# Altium project Sidekick Carrier - Rev. 1.PrjPcb (part 3 of 6)

## Sheet 6 Bluetooth.SchDoc
size B; DocumentNumber: 6; SheetNumber: 6; SheetTotal: 17
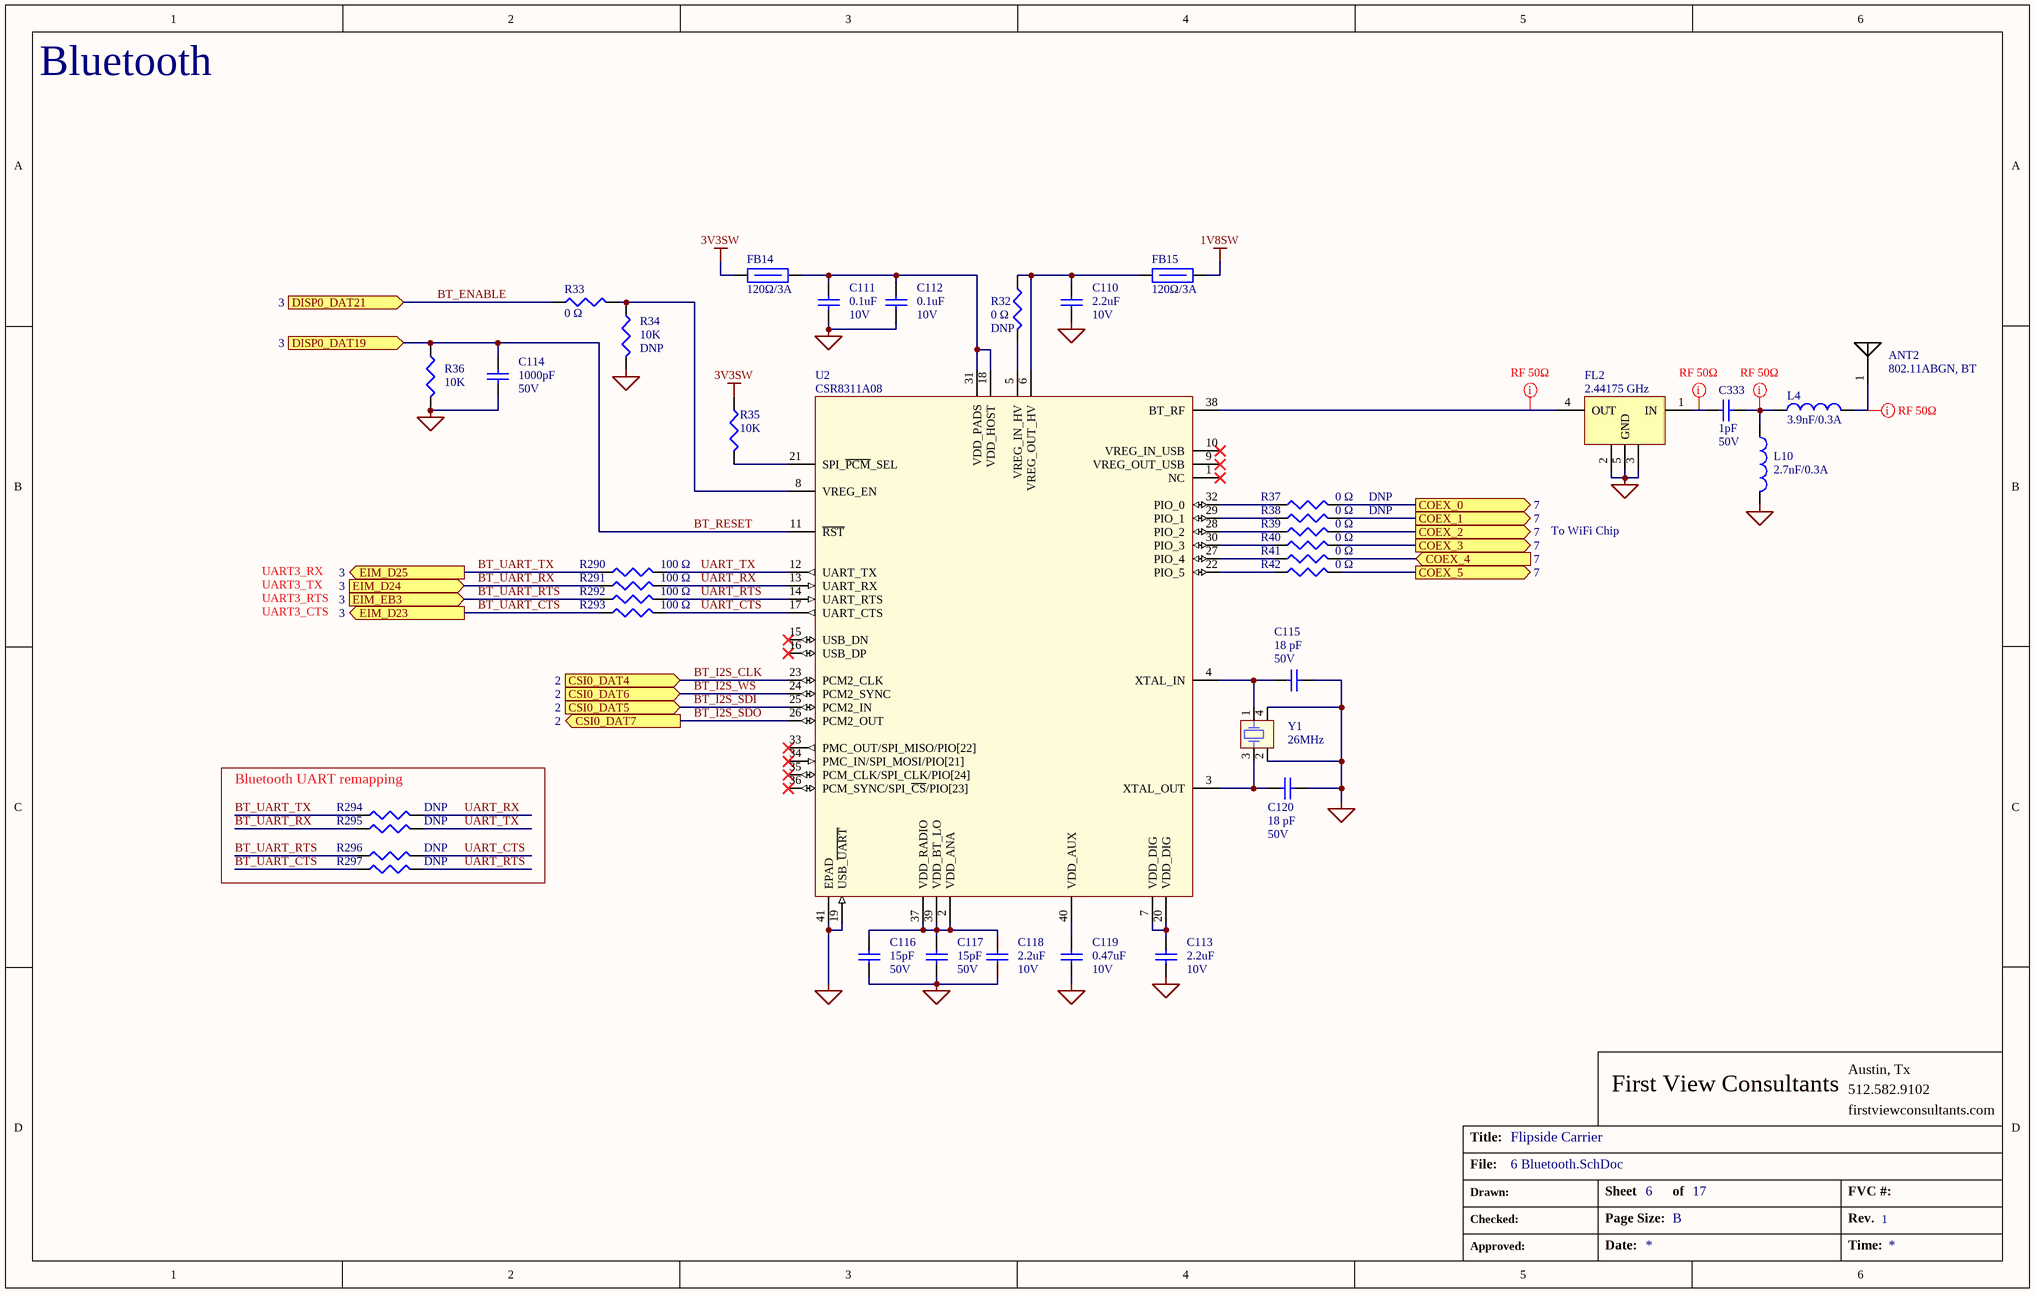
[diagram p5: 6 Bluetooth.SchDoc]

### Parts
ANT2  value 802.11ABGN, BT  [ANT_2450AT18A100E]  (hidden comment: 2450AT18A100E)
C110  value 2.2uF  Voltage: 10V  [CAP_0402]  (hidden comment: Cap 2.2uF 10V 0402)
C111  value 0.1uF  Voltage: 10V  [CAP_0402]  (hidden comment: Cap 0.1uF 10V 0402)
C112  value 0.1uF  Voltage: 10V  [CAP_0402]  (hidden comment: Cap 0.1uF 10V 0402)
C113  value 2.2uF  Voltage: 10V  [CAP_0402]  (hidden comment: Cap 2.2uF 10V 0402)
C114  value 1000pF  Voltage: 50V  [CAP_0603]  (hidden comment: Cap 1000pF 50V 0603)
C115  value 18 pF  Voltage: 50V  [CAP_0402]  (hidden comment: Cap 18pF 50V 0402)
C116  value 15pF  Voltage: 50V  [CAP_0402]  (hidden comment: Cap 15pF 50V 0402)
C117  value 15pF  Voltage: 50V  [CAP_0402]  (hidden comment: Cap 15pF 50V 0402)
C118  value 2.2uF  Voltage: 10V  [CAP_0402]  (hidden comment: Cap 2.2uF 10V 0402)
C119  value 0.47uF  Voltage: 10V  [CAP_0402]  (hidden comment: Cap 0.47uF 10V 0402)
C120  value 18 pF  Voltage: 50V  [CAP_0402]  (hidden comment: Cap 18pF 50V 0402)
C333  value 1pF  Voltage: 50V  [CAP_0402]  (hidden comment: Cap 1pF 50V 0402 RF)
FB14  value 120Ω/3A  [IND_0603]  (hidden comment: BLM18KG121TN1D)
FB15  value 120Ω/3A  [IND_0603]  (hidden comment: BLM18KG121TN1D)
FL2  value 2.44175 GHz  [SMD(1.3x1.1)_B39242B9413K610]  (hidden comment: B39242B9413K610)
L4  value 3.9nF/0.3A  [IND_RF_0402]  (hidden comment: L-07C3N9SV6T)
L10  value 2.7nF/0.3A  [IND_RF_0402]  (hidden comment: L-07C2N7SV6T)
R32  value 0 Ω  [RES_0402]  (hidden comment: Res 0 ohm 0.1W)
R33  value 0 Ω  [RES_0402]  (hidden comment: Res 0 ohm 0.1W)
R34  value 10K  [RES_0402]  (hidden comment: Res 10K 0.063W)
R35  value 10K  [RES_0402]  (hidden comment: Res 10K 0.063W)
R36  value 10K  [RES_0402]  (hidden comment: Res 10K 0.063W)
R37  value 0 Ω  [RES_0402]  (hidden comment: Res 0 ohm 0.1W)
R38  value 0 Ω  [RES_0402]  (hidden comment: Res 0 ohm 0.1W)
R39  value 0 Ω  [RES_0402]  (hidden comment: Res 0 ohm 0.1W)
R40  value 0 Ω  [RES_0402]  (hidden comment: Res 0 ohm 0.1W)
R41  value 0 Ω  [RES_0402]  (hidden comment: Res 0 ohm 0.1W)
R42  value 0 Ω  [RES_0402]  (hidden comment: Res 0 ohm 0.1W)
R290  value 100 Ω  [RES_0402]  (hidden comment: Res 100R 0.063W)
R291  value 100 Ω  [RES_0402]  (hidden comment: Res 100R 0.063W)
R292  value 100 Ω  [RES_0402]  (hidden comment: Res 100R 0.063W)
R293  value 100 Ω  [RES_0402]  (hidden comment: Res 100R 0.063W)
R294  Res 0 ohm 0.1W DNP  [RES_0402]  (value not drawn)
R295  Res 0 ohm 0.1W DNP  [RES_0402]  (value not drawn)
R296  Res 0 ohm 0.1W DNP  [RES_0402]  (value not drawn)
R297  Res 0 ohm 0.1W DNP  [RES_0402]  (value not drawn)
U2  CSR8311A08  [QFN-40_CSR8311A08]
Y1  value 26MHz  [DFN(3.2x2.5)_403I35D26M00000]  (hidden comment: 403I35D26M00000)

### Blocks framed on the sheet
Bluetooth UART remapping: R294-R297

### Ports
COEX_0 (out, see 7), COEX_1 (out, see 7), COEX_2 (out, see 7), COEX_3 (out, see 7), COEX_4 (in, see 7), COEX_5 (out, see 7), CSI0_DAT4 (in, see 2), CSI0_DAT5 (in, see 2), CSI0_DAT6 (in, see 2), CSI0_DAT7 (out, see 2), DISP0_DAT19 (in, see 3), DISP0_DAT21 (in, see 3), EIM_D23 (out, see 3), EIM_D24 (in, see 3), EIM_D25 (out, see 3), EIM_EB3 (in, see 3)

### Nets
1V8SW: FB15.2
3V3SW: FB14.1 R35.1
GND: C110.2 C111.2 C112.2 C113.2 C114.2 C115.1 C116.2 C117.2 C118.2 C119.2 C120.1 FL2.2(GND) FL2.3(GND) FL2.5(GND) L10.2 R34.2 R36.2 U2.19(USB_~{UART}) U2.41(EPAD) Y1.2 Y1.4
BT_ENABLE: R33.1 ; port DISP0_DAT21
BT_I2S_CLK: U2.23(PCM2_CLK) ; port CSI0_DAT4
BT_I2S_SDI: U2.25(PCM2_IN) ; port CSI0_DAT5
BT_I2S_SDO: U2.26(PCM2_OUT) ; port CSI0_DAT7
BT_I2S_WS: U2.24(PCM2_SYNC) ; port CSI0_DAT6
BT_RESET: C114.1 R36.1 U2.11(~{RST}) ; port DISP0_DAT19
BT_UART_CTS: R293.1 R297.1 ; port EIM_D23
BT_UART_RTS: R292.1 R296.1 ; port EIM_EB3
BT_UART_RX: R291.1 R295.1 ; port EIM_D24
BT_UART_TX: R290.1 R294.1 ; port EIM_D25
COEX_0: R37.2 ; port COEX_0
COEX_1: R38.2 ; port COEX_1
COEX_2: R39.2 ; port COEX_2
COEX_3: R40.2 ; port COEX_3
COEX_4: R41.2 ; port COEX_4
COEX_5: R42.2 ; port COEX_5
UART_CTS: R293.2 R296.2 U2.17(UART_CTS)
UART_RTS: R292.2 R297.2 U2.14(UART_RTS)
UART_RX: R291.2 R294.2 U2.13(UART_RX)
UART_TX: R290.2 R295.2 U2.12(UART_TX)
NetANT2_1: ANT2.1 L4.2
NetC110_1: C110.1 FB15.1 R32.1 U2.6(VREG_OUT_HV)
NetC111_1: C111.1 C112.1 FB14.2 U2.18(VDD_HOST) U2.31(VDD_PADS)
NetC113_1: C113.1 U2.7(VDD_DIG) U2.20(VDD_DIG)
NetC115_2: C115.2 U2.4(XTAL_IN) Y1.1(OSC1)
NetC116_1: C116.1 C117.1 C118.1 U2.2(VDD_ANA) U2.37(VDD_RADIO) U2.39(VDD_BT_LO)
NetC119_1: C119.1 U2.40(VDD_AUX)
NetC120_2: C120.2 U2.3(XTAL_OUT) Y1.3(OSC2)
NetC333_1: C333.1 FL2.1(IN)
NetC333_2: C333.2 L4.1 L10.1
NetFL2_4: FL2.4(OUT) U2.38(BT_RF)
NetR32_2: R32.2 U2.5(VREG_IN_HV)
NetR33_2: R33.2 R34.1 U2.8(VREG_EN)
NetR35_2: R35.2 U2.21(SPI_~{PCM}_SEL)
NetR37_1: R37.1 U2.32(PIO_0)
NetR38_1: R38.1 U2.29(PIO_1)
NetR39_1: R39.1 U2.28(PIO_2)
NetR40_1: R40.1 U2.30(PIO_3)
NetR41_1: R41.1 U2.27(PIO_4)
NetR42_1: R42.1 U2.22(PIO_5)

Not connected (* = marked no-connect by the designer): U2 1(NC)* 9(VREG_OUT_USB)* 10(VREG_IN_USB)* 15(USB_DN)* 16(USB_DP)* 33(PMC_OUT/SPI_MISO/PIO[22])* 34(PMC_IN/SPI_MOSI/PIO[21])* 35(PCM_CLK/SPI_CLK/PIO[24])* 36(PCM_SYNC/SPI_~{CS}/PIO[23])*

### Layout directives
net class RF 50ohm: NetANT2_1, NetC333_1, NetC333_2, NetFL2_4

### Notes on the sheet
- Bluetooth
- To WiFi Chip
- UART3_RX
- UART3_TX
- UART3_RTS
- UART3_CTS
- First View Consultants
- Austin, Tx
- 512.582.9102
- Title:
- File:
- firstviewconsultants.com
- Drawn:
- Checked:
- Sheet
- Page Size:
- of
- B
- FVC #:
- Rev.
- Approved:
- Date:
- Time:

### Library data of the parts
ANT2 = 2450AT18A100E: Antenna, WiFi/BT, SMD; Manufacturer: Johanson Technology, Inc.; Manufacturer #: 2450AT18A100E
C110 C113 C118 = Cap 2.2uF 10V 0402: Cap, Cer, 2.2uF, 10V, 10%, X5R, 0402; Manufacturer #: C0402C225M8PACTU; Manufacturer: Kemet; Have Footprint: yes; Package: 0402
C111 C112 = Cap 0.1uF 10V 0402: Cap, Cer, 0.1uF, 10V, 10%, X5R, 0402; Manufacturer: Murata Electronics North America; Manufacturer #: GRM155R61A104KA01J; Have Footprint: yes; Tolerance: ±10%; PACKAGE: 0402
C114 = Cap 1000pF 50V 0603: Cap, Cer, 1000pF, 50V, 10%, X7S, 0603; Manufacturer: Yageo; Manufacturer #: CC0603KRX7R9BB102; Have Footprint: yes; Tolerance: 10%; PACKAGE: 0402
C115 C120 = Cap 18pF 50V 0402: Cap, Cer, 18pF, 50V, 5%, C0G, 0402; Manufacturer #: C1005C0G1H180J050BA; Manufacturer: TDK Corporation; Have Footprint: yes; Package: 0402
C116 C117 = Cap 15pF 50V 0402: Cap, Cer, 15pF, 50V, 5%, C0G/NP0, 0402; Manufacturer: Murata Electronics North America; Manufacturer #: GRM1555C1H150JA01D; Have Footprint: yes; Tolerance: 5%; PACKAGE: 0402
C119 = Cap 0.47uF 10V 0402: Cap, Cer, 0.47uF, 10V, 10%, X5R, 0402; Manufacturer: TDK Corporation; Manufacturer #: C1005X5R1A474K050BB; Have Footprint: yes; Package: 0402; Tolerance: ±10%
C333 = Cap 1pF 50V 0402 RF: Cap, Cer, 0.1uF, 50V, 10%, X5R, 0402; Manufacturer #: CBR04C109C5GAC; Manufacturer: Kemet; Have Footprint: yes; Tolerance: ±10%; PACKAGE: 0402
FB14 FB15 = BLM18KG121TN1D: Ind, Ferrite Bead, 120R, 20mOhm, 3A, 0603; Manufacturer: Murata Electronics North America; Have Footprint: yes; RoHS: yes; Package: 0603; Manufacturer #: BLM18KG121TN1D
FL2 = B39242B9413K610: Filter, Saw, 2.44175 GHz, BT, SMD; Manufacturer: EPCOS (TDK); Package: SMD (1.4x1.1); RoHS: yes; Manufacturer #: B39242B9413K610
L4 = L-07C3N9SV6T: Ind, RF, 3.9nH, 0.3A, 220 mOhm, 0402; Manufacturer: Johanson Technology Inc; RoHS: yes; Operating Temperature: -40°C ~ 100°C; Package: 0402; Manufacturer #: L-07C3N9SV6T
L10 = L-07C2N7SV6T: Ind, RF, 2.7nH, 0.3A, 170 mOhm, 0402; Manufacturer: Johanson Technology Inc; RoHS: yes; Operating Temperature: -40°C ~ 100°C; Package: 0402; Manufacturer #: L-07C2N7SV6T
R32 R33 R37-R42 = Res 0 ohm 0.1W: Res, 0 ohm, 1/16W, 0402; Manufacturer #: CRCW04020000Z0ED; Manufacturer: Vishay Dale; Have Footprint: yes; Package: 0402
  R32 R37 R38: DNP: DNP
R34-R36 = Res 10K 0.063W: Res, 10K, 1/16W, 1%, 0402; Manufacturer #: RC0402FR-0710KL; Manufacturer: Yageo; Have Footprint: yes; Package: 0402
  R34: DNP: DNP
R290-R293 = Res 100R 0.063W: Res, 100R, 0.063W, 1%, 0402; Manufacturer #: TRR01MZPF1000; Manufacturer: Murata Electronics North America; Have Footprint: yes; Package: 0402
R294-R297 = Res 0 ohm 0.1W DNP: Res, 0 ohm, 1/16W, 0402; Manufacturer #: CRCW04020000Z0ED; Manufacturer: Vishay Dale; Have Footprint: yes; Value: 0 Ω; Package: 0402; DNP: DNP
U2 = CSR8311A08: IC, Bluetooth, 40-QFN; Manufacturer: CSR PLC; Manufacturer #: CSR8311A08-AQQD-R; Have Footprint: yes; Cost: 3.0048; Value: CSR8311A08; Package: QFN-40
Y1 = 403I35D26M00000: Clock, Crystal, 26MHz, 50ppm, 18pf, -40+85°C, SMD; Manufacturer: CTS-Frequency Controls; Package: DFN(3.2x2.5mm); Manufacturer #: 403I35D26M00000

## Sheet 7 WiFi.SchDoc
size C; DocumentNumber: 7; SheetNumber: 7; SheetTotal: 17
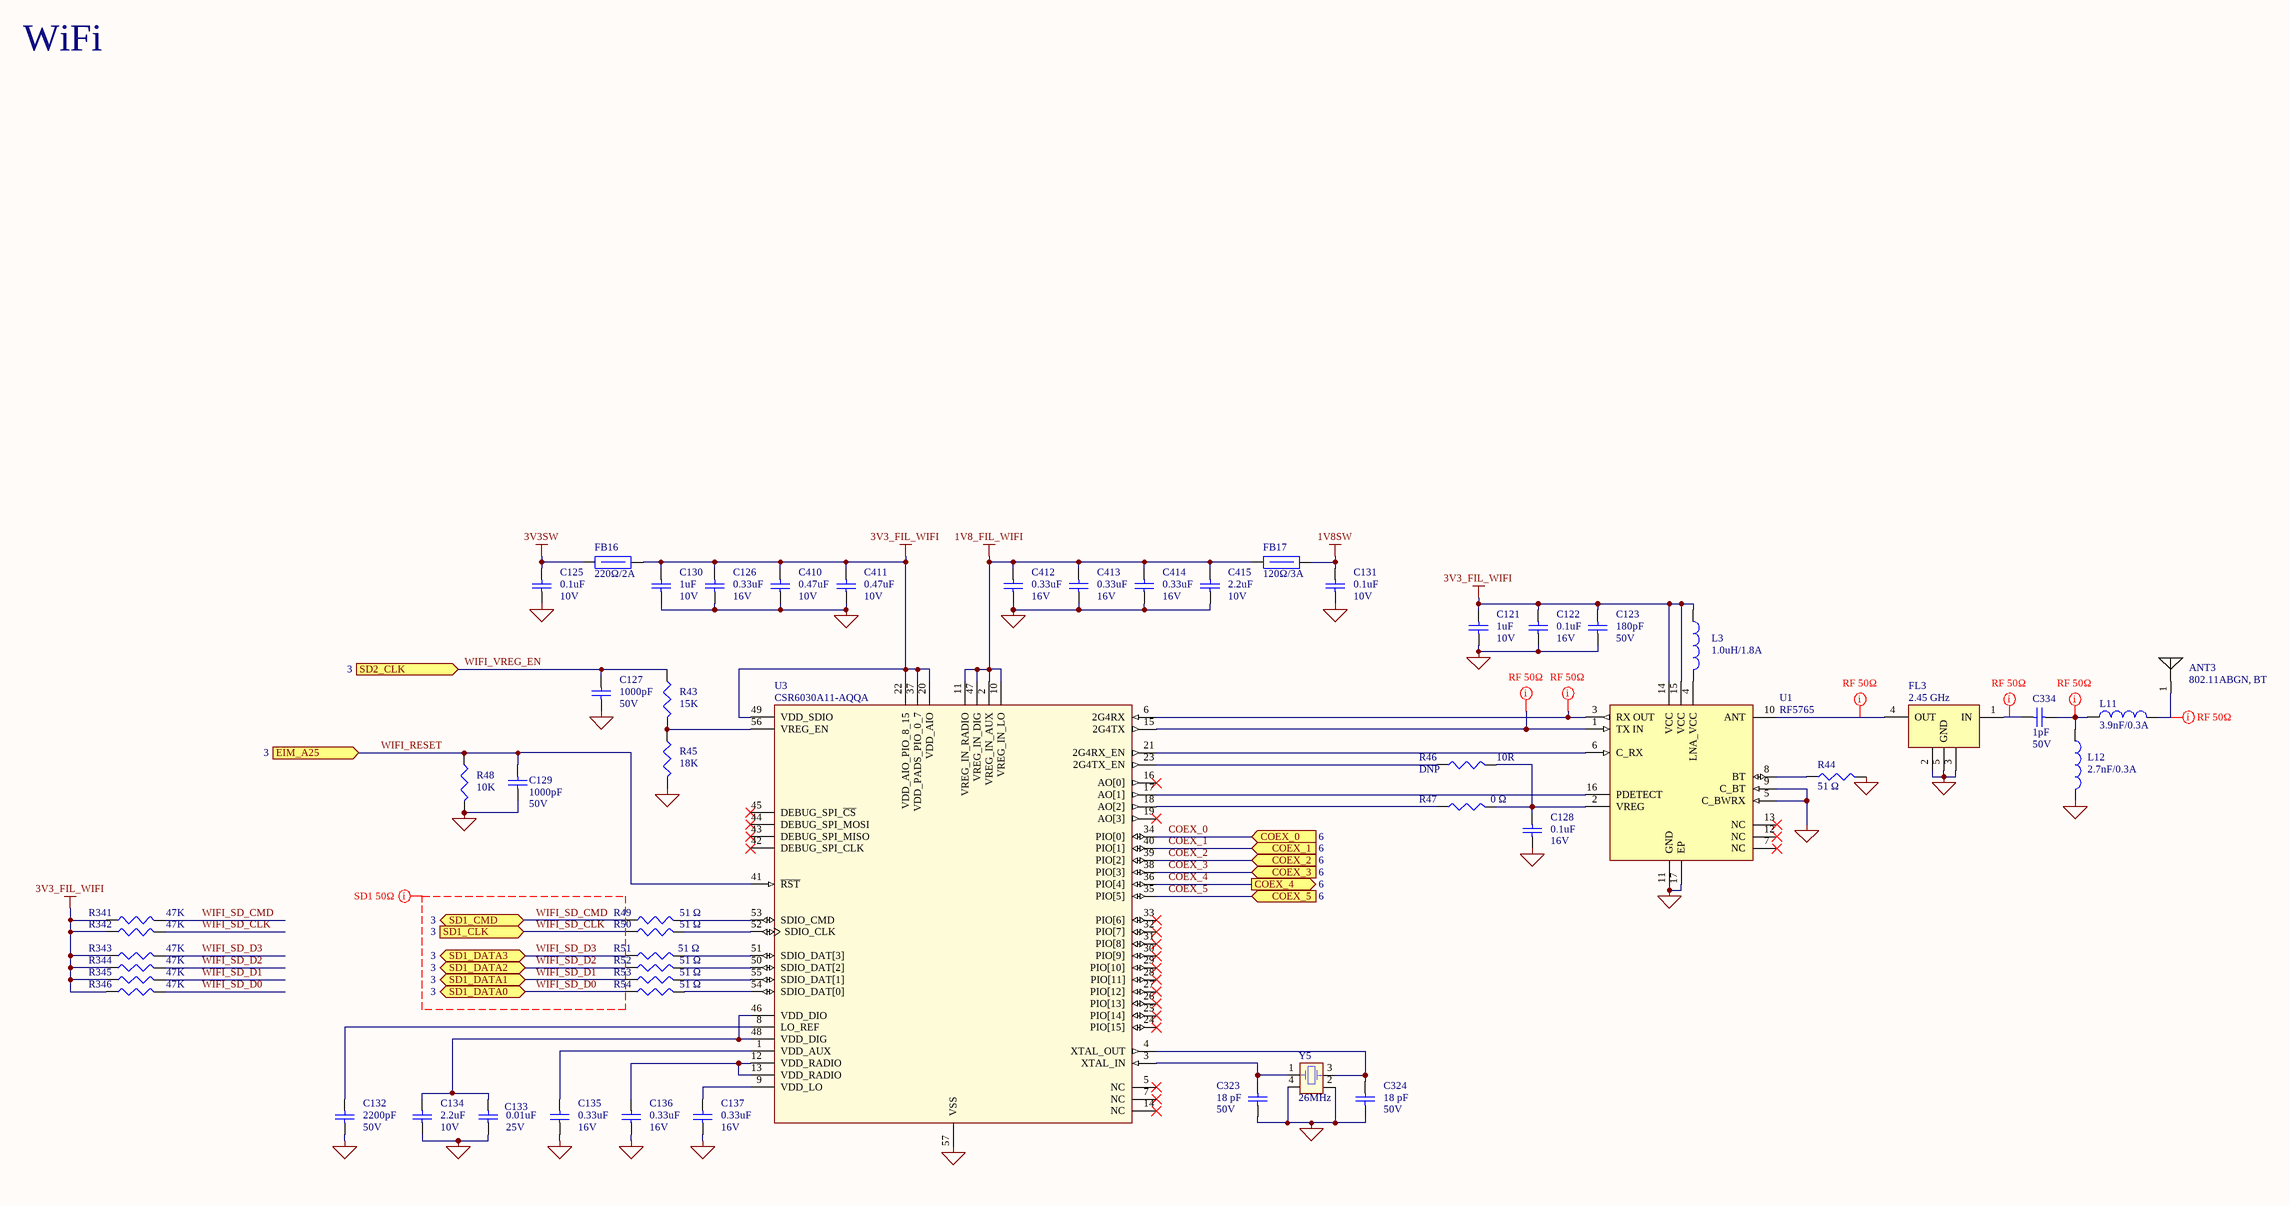
[diagram p6: 7 WiFi.SchDoc]

### Parts
ANT3  value 802.11ABGN, BT  [ANT_2450AT18A100E]  (hidden comment: 2450AT18A100E)
C121  value 1uF  Voltage: 10V  [CAP_0402]  (hidden comment: Cap 1uF 10V 0402)
C122  value 0.1uF  Voltage: 16V  [CAP_0402]  (hidden comment: Cap 0.1uF 16V 0402)
C123  value 180pF  Voltage: 50V  [CAP_0402]  (hidden comment: Cap 180pF 50V 0402)
C125  value 0.1uF  Voltage: 10V  [CAP_0402]  (hidden comment: Cap 0.1uF 10V 0402)
C126  value 0.33uF  Voltage: 16V  [CAP_0402]  (hidden comment: Cap 0.33uF 16V 0402)
C127  value 1000pF  Voltage: 50V  [CAP_0603]  (hidden comment: Cap 1000pF 50V 0603)
C128  value 0.1uF  Voltage: 16V  [CAP_0402]  (hidden comment: Cap 0.1uF 16V 0402)
C129  value 1000pF  Voltage: 50V  [CAP_0603]  (hidden comment: Cap 1000pF 50V 0603)
C130  value 1uF  Voltage: 10V  [CAP_0402]  (hidden comment: Cap 1uF 10V 0402)
C131  value 0.1uF  Voltage: 10V  [CAP_0402]  (hidden comment: Cap 0.1uF 10V 0402)
C132  value 2200pF  Voltage: 50V  [CAP_0402]  (hidden comment: Cap 2200pF 50V 0402)
C133  value 0.01uF  Voltage: 25V  [CAP_0402]  (hidden comment: Cap 0.01uF 50V 0402)
C134  value 2.2uF  Voltage: 10V  [CAP_0402]  (hidden comment: Cap 2.2uF 10V 0402)
C135  value 0.33uF  Voltage: 16V  [CAP_0402]  (hidden comment: Cap 0.33uF 16V 0402)
C136  value 0.33uF  Voltage: 16V  [CAP_0402]  (hidden comment: Cap 0.33uF 16V 0402)
C137  value 0.33uF  Voltage: 16V  [CAP_0402]  (hidden comment: Cap 0.33uF 16V 0402)
C323  value 18 pF  Voltage: 50V  [CAP_0402]  (hidden comment: Cap 18pF 50V 0402)
C324  value 18 pF  Voltage: 50V  [CAP_0402]  (hidden comment: Cap 18pF 50V 0402)
C334  value 1pF  Voltage: 50V  [CAP_0402]  (hidden comment: Cap 1pF 50V 0402 RF)
C410  value 0.47uF  Voltage: 10V  [CAP_0402]  (hidden comment: Cap 0.47uF 10V 0402)
C411  value 0.47uF  Voltage: 10V  [CAP_0402]  (hidden comment: Cap 0.47uF 10V 0402)
C412  value 0.33uF  Voltage: 16V  [CAP_0402]  (hidden comment: Cap 0.33uF 16V 0402)
C413  value 0.33uF  Voltage: 16V  [CAP_0402]  (hidden comment: Cap 0.33uF 16V 0402)
C414  value 0.33uF  Voltage: 16V  [CAP_0402]  (hidden comment: Cap 0.33uF 16V 0402)
C415  value 2.2uF  Voltage: 10V  [CAP_0402]  (hidden comment: Cap 2.2uF 10V 0402)
FB16  value 220Ω/2A  [IND_0805]  (hidden comment: BKP2125HS221-T)
FB17  value 120Ω/3A  [IND_0603]  (hidden comment: BLM18KG121TN1D)
FL3  value 2.45 GHz  [SMD(1.3x1.1)_B39252B9430M410]  (hidden comment: B39252B9430M410)
L3  value 1.0uH/1.8A  [IND_VLS252010T-1R0N]  (hidden comment: VLS252010T-1R0N)
L11  value 3.9nF/0.3A  [IND_RF_0402]  (hidden comment: L-07C3N9SV6T)
L12  value 2.7nF/0.3A  [IND_RF_0402]  (hidden comment: L-07C2N7SV6T)
R43  value 15K  [RES_0402]  (hidden comment: Res 15K 0.1W)
R44  value 51 Ω  [RES_0402]  (hidden comment: Res 51R 0.063W)
R45  value 18K  [RES_0402]  (hidden comment: Res 18K 0.063W)
R46  value 10R  [RES_0402]  (hidden comment: Res 10R 0.1W)
R47  value 0 Ω  [RES_0402]  (hidden comment: Res 0 ohm 0.1W)
R48  value 10K  [RES_0402]  (hidden comment: Res 10K 0.063W)
R49  value 51 Ω  [RES_0402]  (hidden comment: Res 51R 0.063W)
R50  value 51 Ω  [RES_0402]  (hidden comment: Res 51R 0.063W)
R51  value 51 Ω  [RES_0402]  (hidden comment: Res 51R 0.063W)
R52  value 51 Ω  [RES_0402]  (hidden comment: Res 51R 0.063W)
R53  value 51 Ω  [RES_0402]  (hidden comment: Res 51R 0.063W)
R54  value 51 Ω  [RES_0402]  (hidden comment: Res 51R 0.063W)
R341  value 47K  [RES_0402]  (hidden comment: Res 47K 0.1W)
R342  value 47K  [RES_0402]  (hidden comment: Res 47K 0.1W)
R343  value 47K  [RES_0402]  (hidden comment: Res 47K 0.1W)
R344  value 47K  [RES_0402]  (hidden comment: Res 47K 0.1W)
R345  value 47K  [RES_0402]  (hidden comment: Res 47K 0.1W)
R346  value 47K  [RES_0402]  (hidden comment: Res 47K 0.1W)
U1  RF5765  [QFN-16_RF5765]
U3  CSR6030A11-AQQA  [QFN-56_CSR6030A11-AQQA]
Y5  value 26MHz  [DFN(3.2x2.5)_403I35D26M00000]  (hidden comment: 403I35D26M00000)

### Ports
COEX_0 (in, see 6), COEX_1 (in, see 6), COEX_2 (in, see 6), COEX_3 (in, see 6), COEX_4 (out, see 6), COEX_5 (in, see 6), EIM_A25 (in, see 3), SD1_CLK (in, see 3), SD1_CMD (bidir, see 3), SD1_DATA0 (bidir, see 3), SD1_DATA1 (bidir, see 3), SD1_DATA2 (bidir, see 3), SD1_DATA3 (bidir, see 3), SD2_CLK (in, see 3)

### Nets
1V8_FIL_WIFI: C412.1 C413.1 C414.1 C415.1 FB17.1 U3.2(VREG_IN_AUX) U3.10(VREG_IN_LO) U3.11(VREG_IN_RADIO) U3.47(VREG_IN_DIG)
1V8SW: C131.1 FB17.2
3V3_FIL_WIFI: C121.1 C122.1 C123.1 C126.1 C130.1 C410.1 C411.1 FB16.2 L3.1 R341.1 R342.1 R343.1 R344.1 R345.1 R346.1 U1.14(VCC) U1.15(VCC) U3.20(VDD_AIO) U3.22(VDD_AIO_PIO_8_15) U3.37(VDD_PADS_PIO_0_7) U3.49(VDD_SDIO)
3V3SW: C125.1 FB16.1
GND: C121.2 C122.2 C123.2 C125.2 C126.2 C127.2 C128.2 C129.2 C130.2 C131.2 C132.2 C133.2 C134.2 C135.2 C136.2 C137.2 C323.2 C324.2 C410.2 C411.2 C412.2 C413.2 C414.2 C415.2 FL3.2(GND) FL3.3(GND) FL3.5(GND) L12.2 R44.2 R45.2 R48.2 U1.5(C_BWRX) U1.9(C_BT) U1.11(GND) U1.17(EP) U3.57(VSS) Y5.2 Y5.4
COEX_0: U3.34(PIO[0]) ; port COEX_0
COEX_1: U3.40(PIO[1]) ; port COEX_1
COEX_2: U3.39(PIO[2]) ; port COEX_2
COEX_3: U3.38(PIO[3]) ; port COEX_3
COEX_4: U3.36(PIO[4]) ; port COEX_4
COEX_5: U3.35(PIO[5]) ; port COEX_5
WIFI_RESET: C129.1 R48.1 U3.41(~{RST}) ; port EIM_A25
WIFI_SD_CLK: R50.1 R342.2 ; port SD1_CLK
WIFI_SD_CMD: R49.1 R341.2 ; port SD1_CMD
WIFI_SD_D0: R54.1 R346.2 ; port SD1_DATA0
WIFI_SD_D1: R53.1 R345.2 ; port SD1_DATA1
WIFI_SD_D2: R52.1 R344.2 ; port SD1_DATA2
WIFI_SD_D3: R51.1 R343.2 ; port SD1_DATA3
WIFI_VREG_EN: C127.1 R43.1 ; port SD2_CLK
NetANT3_1: ANT3.1 L11.2
NetC128_1: C128.1 R46.2 R47.2 U1.2(VREG)
NetC132_1: C132.1 U3.8(LO_REF)
NetC133_1: C133.1 C134.1 U3.46(VDD_DIO) U3.48(VDD_DIG)
NetC135_1: C135.1 U3.1(VDD_AUX)
NetC136_1: C136.1 U3.12(VDD_RADIO) U3.13(VDD_RADIO)
NetC137_1: C137.1 U3.9(VDD_LO)
NetC323_1: C323.1 U3.3(XTAL_IN) Y5.1(OSC1)
NetC324_1: C324.1 U3.4(XTAL_OUT) Y5.3(OSC2)
NetC334_1: C334.1 FL3.1(IN)
NetC334_2: C334.2 L11.1 L12.1
NetFL3_4: FL3.4(OUT) U1.10(ANT)
NetL3_2: L3.2 U1.4(LNA_VCC)
NetR43_2: R43.2 R45.1 U3.56(VREG_EN)
NetR44_1: R44.1 U1.8(BT)
NetR46_1: R46.1 U3.23(2G4TX_EN)
NetR47_1: R47.1 U3.18(AO[2])
NetR49_2: R49.2 U3.53(SDIO_CMD)
NetR50_2: R50.2 U3.52(SDIO_CLK)
NetR51_2: R51.2 U3.51(SDIO_DAT[3])
NetR52_2: R52.2 U3.50(SDIO_DAT[2])
NetR53_2: R53.2 U3.55(SDIO_DAT[1])
NetR54_2: R54.2 U3.54(SDIO_DAT[0])
NetU1_1: U1.1(TX_IN) U3.15(2G4TX)
NetU1_3: U1.3(RX_OUT) U3.6(2G4RX)
NetU1_6: U1.6(C_RX) U3.21(2G4RX_EN)
NetU1_16: U1.16(PDETECT) U3.17(AO[1])

Not connected (* = marked no-connect by the designer): U1 7(NC)* 12(NC)* 13(NC)*; U3 5(NC)* 7(NC)* 14(NC)* 16(AO[0])* 19(AO[3])* 24(PIO[15])* 25(PIO[14])* 26(PIO[13])* 27(PIO[12])* 28(PIO[11])* 29(PIO[10])* 30(PIO[9])* 31(PIO[8])* 32(PIO[7])* 33(PIO[6])* 42(DEBUG_SPI_CLK)* 43(DEBUG_SPI_MISO)* 44(DEBUG_SPI_MOSI)* 45(DEBUG_SPI_~{CS})*

### Layout directives
net class RF 50ohm: NetANT3_1, NetC334_1, NetC334_2, NetFL3_4, NetU1_1, NetU1_3
net class SD1 50ohm: WIFI_SD_CLK, WIFI_SD_CMD, WIFI_SD_D0, WIFI_SD_D1, WIFI_SD_D2, WIFI_SD_D3

### Notes on the sheet
- WiFi
- First View Consultants
- Austin, Tx
- 512.582.9102
- firstviewconsultants.com
- Title:
- File:
- Drawn:
- Sheet
- of
- FVC #:
- Checked:
- Approved:
- Date:
- Page Size:
- C
- Rev.
- Time:

### Library data of the parts
ANT3 = 2450AT18A100E: as ANT2 on sheet 6 Bluetooth; Manufacturer #: 2450AT18A100E
C121 C130 = Cap 1uF 10V 0402: Cap, Cer, 1uF, 10V, ±10%, X5R, 0402; Manufacturer #: CC0402KRX5R6BB105; Manufacturer: Yageo; Have Footprint: yes; Package: 0402
C122 C128 = Cap 0.1uF 16V 0402: Cap, Cer, 0.1uF, 16V, 10%, X7R, 0402; Manufacturer #: GRM155R71C104KA88D; Manufacturer: Murata Electronics North America; Have Footprint: yes; Package: 0402; Tolerance: ±10%
C123 = Cap 180pF 50V 0402: Cap, Cer, 180pF, 50V, 5%, NP0, 0402; Manufacturer: Murata Electronics North America; Manufacturer #: GRM1555C1H181JA01J; Have Footprint: yes; Tolerance: 5%; PACKAGE: 0402
C125 C131 = Cap 0.1uF 10V 0402: as C111 on sheet 6 Bluetooth; Tolerance: ±10%; PACKAGE: 0402
C126 C135-C137 C412-C414 = Cap 0.33uF 16V 0402: Cap, Cer, 0.33uF, 16V, 10%, X5R, 0402; Manufacturer: TDK Corporation; Manufacturer #: C1005X5R1C334K050BC; Have Footprint: yes; Tolerance: 10%; PACKAGE: 0402
C127 C129 = Cap 1000pF 50V 0603: as C114 on sheet 6 Bluetooth; Tolerance: 10%; PACKAGE: 0402
C132 = Cap 2200pF 50V 0402: Cap, Cer, 2200pF, 50V, 5%, X7R, 0402; Manufacturer #: GRM155R71H222JA01J; Manufacturer: Murata Electronics North America; Have Footprint: yes; Package: 0402; Tolerance: 5%
C133 = Cap 0.01uF 50V 0402: Cap, Cer, 0.01uF, 25V, ±10%, X7R, 0402; Manufacturer #: GRM155R71E103KA01J; Manufacturer: Murata; Have Footprint: yes; Tolerance: ±10%; Package: 0402
C134 C415 = Cap 2.2uF 10V 0402: as C110 on sheet 6 Bluetooth; Package: 0402
C323 C324 = Cap 18pF 50V 0402: as C115 on sheet 6 Bluetooth; Package: 0402
C334 = Cap 1pF 50V 0402 RF: as C333 on sheet 6 Bluetooth; Tolerance: ±10%; PACKAGE: 0402
C410 C411 = Cap 0.47uF 10V 0402: as C119 on sheet 6 Bluetooth; Package: 0402; Tolerance: ±10%
FB16 = BKP2125HS221-T: Ind, Ferrite Bead, 220R, 50mOhm, 2A, 0805; Manufacturer: Taiyo Yuden; Manufacturer #: BKP2125HS221-T; Package: 0805
FB17 = BLM18KG121TN1D: as FB14 on sheet 6 Bluetooth; RoHS: yes; Package: 0603; Manufacturer #: BLM18KG121TN1D
FL3 = B39252B9430M410: Filter, Saw, 2.45 GHz, WLAN, SMD; Manufacturer: EPCOS (TDK); Package: SMD (1.4x1.1); RoHS: yes; Manufacturer #: B39252B9430M410
L3 = VLS252010T-1R0N: Ind, Power, 1uH, 1.8A, 85mOhm, Shielded, SMD; Manufacturer: TDK Corporation; Tolerance: ±20%; Package: SMD (2.5x2); Manufacturer #: VLS252010T-1R0N
L11 = L-07C3N9SV6T: as L4 on sheet 6 Bluetooth; RoHS: yes; Operating Temperature: -40°C ~ 100°C; Package: 0402; Manufacturer #: L-07C3N9SV6T
L12 = L-07C2N7SV6T: as L10 on sheet 6 Bluetooth; RoHS: yes; Operating Temperature: -40°C ~ 100°C; Package: 0402; Manufacturer #: L-07C2N7SV6T
R43 = Res 15K 0.1W: Res, 15K, 0.1W, 1%, 0402; Manufacturer #: ERJ-2GEJ153X; Manufacturer: Panasonic Electronic Components; Have Footprint: yes; Package: 0402
R44 R49-R54 = Res 51R 0.063W: Res, 51R, 0.063W, 1%, 0402; Manufacturer #: MCR01MRTF51R0; Manufacturer: Rohm Semiconductor; Have Footprint: yes; Package: 0402
R45 = Res 18K 0.063W: Res, 18K, 0.063W, 1%, 0402; Manufacturer #: MCR01MRTF1802; Manufacturer: Rohm Semiconductor; Have Footprint: yes; Package: 0402; Tolerance: 1%
R46 = Res 10R 0.1W: Res, 10R, 0.1W, 0402; Manufacturer #: ERJ-2GEJ100X; Manufacturer: Panasonic Electronic Components; Have Footprint: yes; DNP: DNP; Package: 0402
R47 = Res 0 ohm 0.1W: as R32 on sheet 6 Bluetooth; Package: 0402
R48 = Res 10K 0.063W: as R34-R36 on sheet 6 Bluetooth; Package: 0402
R341-R346 = Res 47K 0.1W: Res, 47K, 0.1W, 1%, 0402; Manufacturer #: ERJ-2RKF4702X; Manufacturer: Panasonic Electronic Components; Have Footprint: yes; Package: 0402
U1 = RF5765: IC, WiFi 802.11b/g/n FEM, 3-4.8V, 2.4-2.5GHz, QFN-16; Manufacturer: RFMD; Have Footprint: yes; RoHS: yes; Manufacturer #: RF5765
U3 = CSR6030A11-AQQA: IC, WiFi, QFN-56; Manufacturer: CSR PLC; Value: CSR6030A11-AQQA; Manufacturer #: CSR6030A11-AQQA; Package: QFN-56
Y5 = 403I35D26M00000: as Y1 on sheet 6 Bluetooth; Package: DFN(3.2x2.5mm); Manufacturer #: 403I35D26M00000

## Sheet 8 GPS.SchDoc
size B; DocumentNumber: 8; SheetNumber: 8; SheetTotal: 17
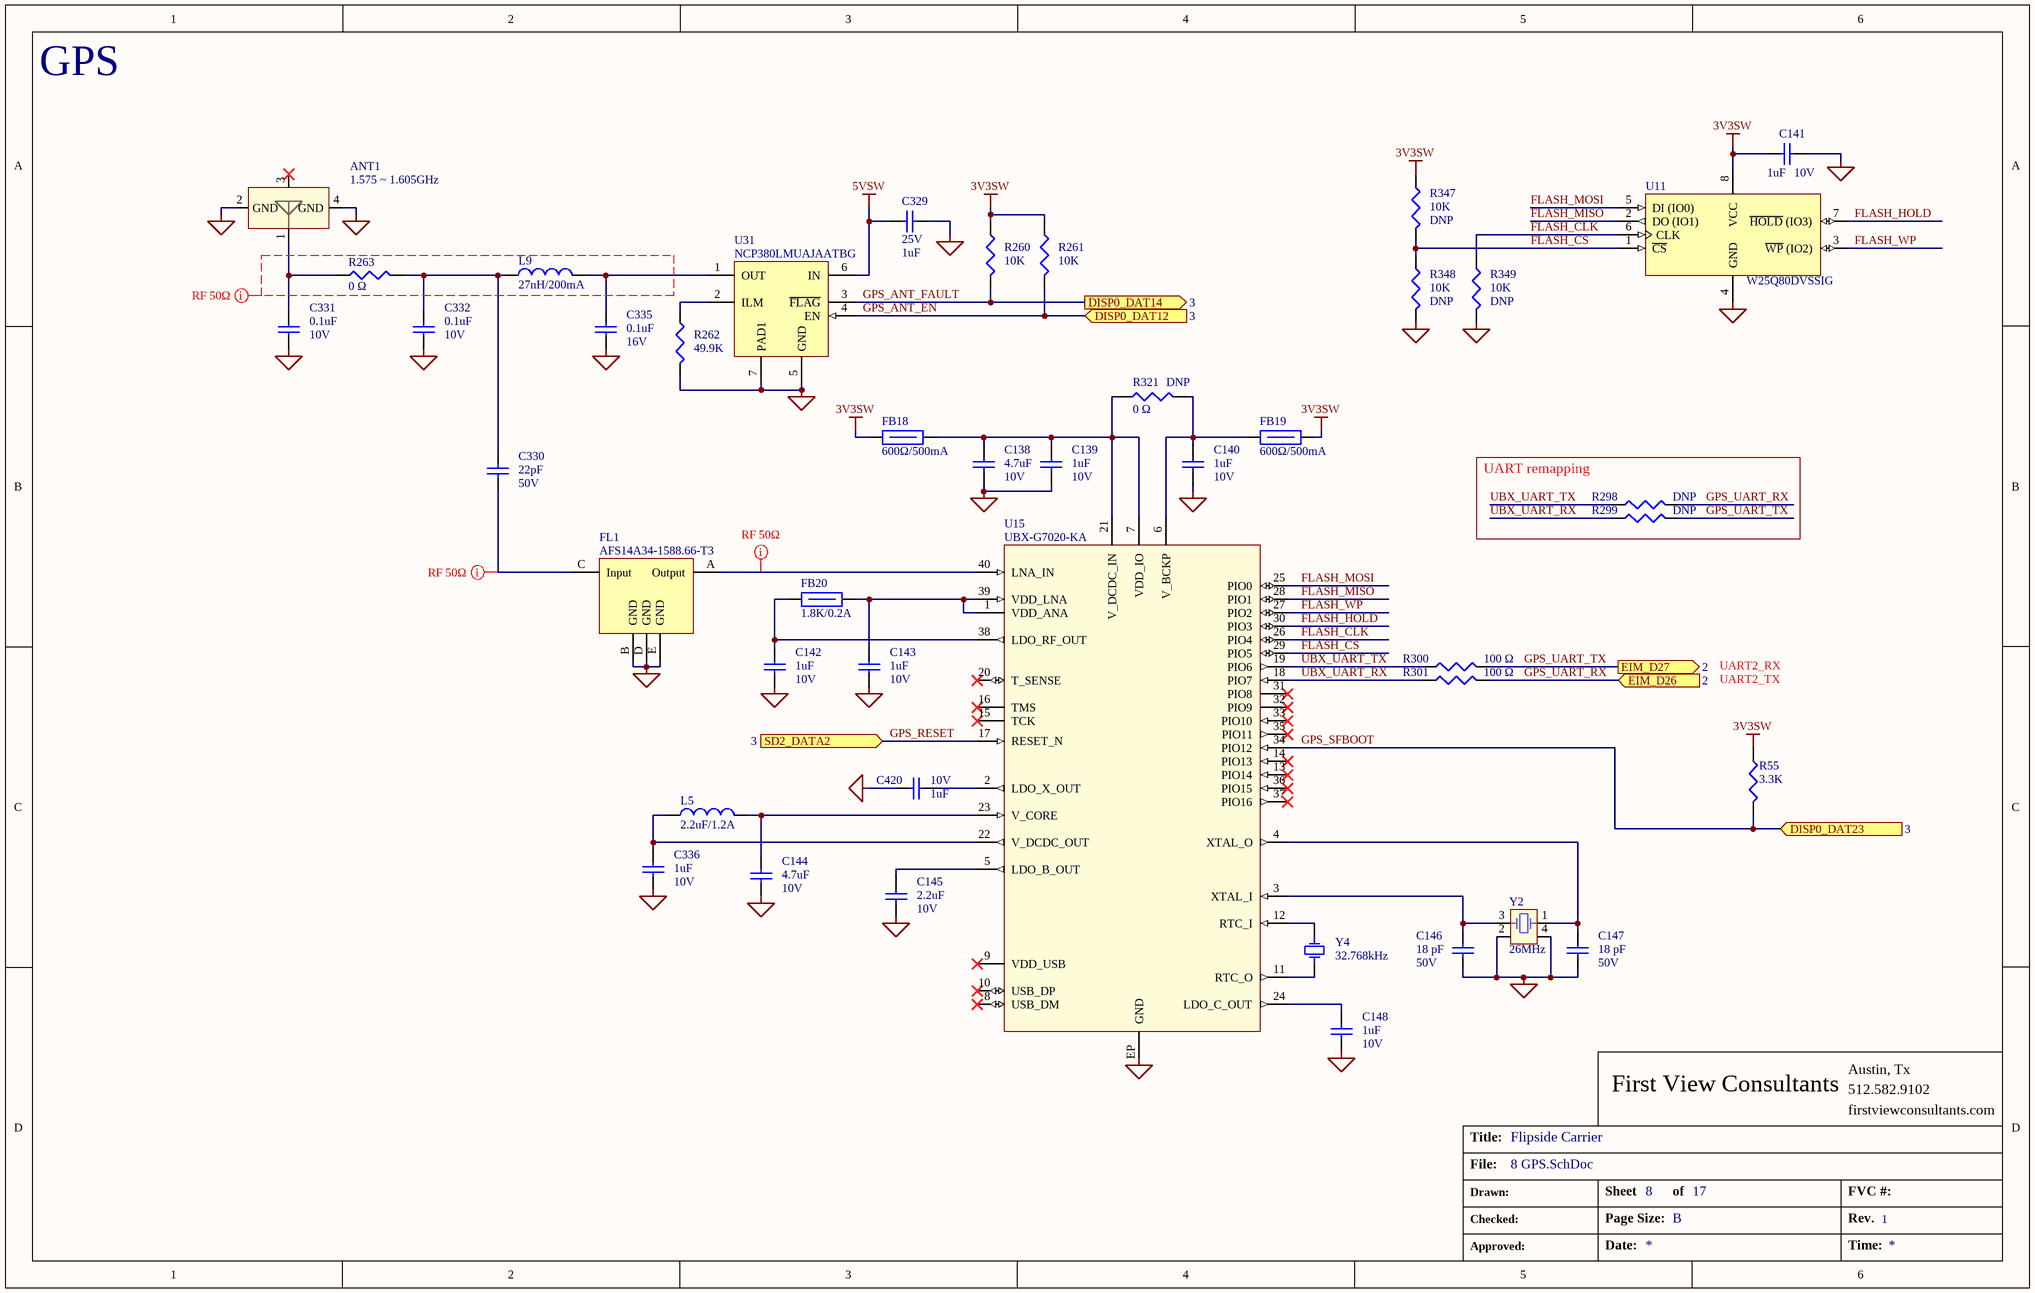
[diagram p7: 8 GPS.SchDoc]

### Parts
ANT1  value 1.575 ~ 1.605GHz  [ANT_1575AT54A0010E]  (hidden comment: 1575AT54A0010E)
C138  value 4.7uF  Voltage: 10V  [CAP_0402]  (hidden comment: Cap 4.7uF 10V 0603)
C139  value 1uF  Voltage: 10V  [CAP_0402]  (hidden comment: Cap 1uF 10V 0402)
C140  value 1uF  Voltage: 10V  [CAP_0402]  (hidden comment: Cap 1uF 10V 0402)
C141  value 1uF  Voltage: 10V  [CAP_0402]  (hidden comment: Cap 1uF 10V 0402)
C142  value 1uF  Voltage: 10V  [CAP_0402]  (hidden comment: Cap 1uF 10V 0402)
C143  value 1uF  Voltage: 10V  [CAP_0402]  (hidden comment: Cap 1uF 10V 0402)
C144  value 4.7uF  Voltage: 10V  [CAP_0402]  (hidden comment: Cap 4.7uF 10V 0603)
C145  value 2.2uF  Voltage: 10V  [CAP_0402]  (hidden comment: Cap 2.2uF 10V 0402)
C146  value 18 pF  Voltage: 50V  [CAP_0402]  (hidden comment: Cap 18pF 50V 0402)
C147  value 18 pF  Voltage: 50V  [CAP_0402]  (hidden comment: Cap 18pF 50V 0402)
C148  value 1uF  Voltage: 10V  [CAP_0402]  (hidden comment: Cap 1uF 10V 0402)
C329  value 1uF  Voltage: 25V  [CAP_0402]  (hidden comment: Cap 1uF 25V 0402)
C330  value 22pF  Voltage: 50V  [CAP_0402]  (hidden comment: Cap 22pF 50V 0402)
C331  value 0.1uF  Voltage: 10V  [CAP_0402]  (hidden comment: Cap 0.1uF 10V 0402)
C332  value 0.1uF  Voltage: 10V  [CAP_0402]  (hidden comment: Cap 0.1uF 10V 0402)
C335  value 0.1uF  Voltage: 16V  [CAP_0402]  (hidden comment: Cap 0.1uF 16V 0402)
C336  value 1uF  Voltage: 10V  [CAP_0402]  (hidden comment: Cap 1uF 10V 0402)
C420  value 1uF  Voltage: 10V  [CAP_0402]  (hidden comment: Cap 1uF 10V 0402)
FB18  value 600Ω/500mA  [IND_0603]  (hidden comment: BLM18EG601SN1D)
FB19  value 600Ω/500mA  [IND_0603]  (hidden comment: BLM18EG601SN1D)
FB20  value 1.8K/0.2A  [IND_0402]  (hidden comment: BLM15HD182SN1)
FL1  AFS14A34-1588.66-T3  [SMD(1.4x1.1)_AFS14A34-1588.66-T3]
L5  value 2.2uF/1.2A  [IND_0806]  (hidden comment: LQM2MPN2R2NG0L)
L9  value 27nH/200mA  [IND_0402]  (hidden comment: L-07C27NJV6T)
R55  value 3.3K  [RES_0402]  (hidden comment: Res 3.3K 0.063W)
R260  value 10K  [RES_0402]  (hidden comment: Res 10K 0.063W)
R261  value 10K  [RES_0402]  (hidden comment: Res 10K 0.063W)
R262  value 49.9K  [RES_0402]  (hidden comment: Res 49.9K 0.063W)
R263  value 0 Ω  [RES_0402]  (hidden comment: Res 0 ohm 0.1W)
R298  Res 0 ohm 0.1W DNP  [RES_0402]  (value not drawn)
R299  Res 0 ohm 0.1W DNP  [RES_0402]  (value not drawn)
R300  value 100 Ω  [RES_0402]  (hidden comment: Res 100R 0.063W)
R301  value 100 Ω  [RES_0402]  (hidden comment: Res 100R 0.063W)
R321  value 0 Ω  [RES_0402]  (hidden comment: Res 0 ohm 0.1W)
R347  value 10K  [RES_0402]  (hidden comment: Res 10K 0.063W)
R348  value 10K  [RES_0402]  (hidden comment: Res 10K 0.063W)
R349  value 10K  [RES_0402]  (hidden comment: Res 10K 0.063W)
U11  W25Q80DVSSIG  [SOIC-8_W25Q80DVSSIG]
U15  UBX-G7020-KA  [QFN-40_UBX-G7020-KA]
U31  NCP380LMUAJAATBG  [UDFN-6_NCP380LMUAJAATBG]
Y2  value 26MHz  [DFN(3.2x2.5)_403I35D26M00000]  (hidden comment: 403I35D26M00000)
Y4  value 32.768kHz  [SMD(3.2x1.5)_SC32S-12.5PF20PPM]  (hidden comment: SC32S-12.5PF20PPM)

### Blocks framed on the sheet
UART remapping: R298 R299

### Ports
DISP0_DAT12 (in, see 3), DISP0_DAT14 (out, see 3), DISP0_DAT23 (in, see 3), EIM_D26 (in, see 2), EIM_D27 (out, see 2), SD2_DATA2 (in, see 3)

### Nets
3V3SW: C141.1 FB18.1 FB19.2 R55.1 R260.1 R261.1 R347.1 U11.8(VCC)
5VSW: C329.1 U31.6(IN)
GND: ANT1.2(GND) ANT1.4(GND) C138.2 C139.2 C140.2 C141.2 C142.2 C143.2 C144.2 C145.2 C146.1 C147.1 C148.2 C329.2 C331.1 C332.1 C335.2 C336.2 C420.2 FL1.B(GND) FL1.D(GND) FL1.E(GND) R262.2 R348.2 R349.2 U11.4(GND) U15.EP(GND) U31.5(GND) U31.7(PAD1) Y2.2 Y2.4
FLASH_CLK: R349.1 U11.6(CLK) U15.26(PIO4)
FLASH_CS: R347.2 R348.1 U11.1(~{CS}) U15.29(PIO5)
FLASH_HOLD: U11.7(~{HOLD}_(IO3)) U15.30(PIO3)
FLASH_MISO: U11.2(DO_(IO1)) U15.28(PIO1)
FLASH_MOSI: U11.5(DI_(IO0)) U15.25(PIO0)
FLASH_WP: U11.3(~{WP}_(IO2)) U15.27(PIO2)
GPS_ANT_EN: R261.2 U31.4(EN) ; port DISP0_DAT12
GPS_ANT_FAULT: R260.2 U31.3(~{FLAG}) ; port DISP0_DAT14
GPS_RESET: U15.17(RESET_N) ; port SD2_DATA2
GPS_SFBOOT: R55.2 U15.34(PIO12) ; port DISP0_DAT23
GPS_UART_RX: R298.2 R301.2 ; port EIM_D26
GPS_UART_TX: R299.2 R300.2 ; port EIM_D27
UBX_UART_RX: R299.1 R301.1 U15.18(PIO7)
UBX_UART_TX: R298.1 R300.1 U15.19(PIO6)
NetANT1_1: ANT1.1 C331.2 R263.1
NetC138_1: C138.1 C139.1 FB18.2 R321.1 U15.7(VDD_IO) U15.21(V_DCDC_IN)
NetC140_1: C140.1 FB19.1 R321.2 U15.6(V_BCKP)
NetC142_1: C142.1 FB20.1 U15.38(LDO_RF_OUT)
NetC143_1: C143.1 FB20.2 U15.1(VDD_ANA) U15.39(VDD_LNA)
NetC144_1: C144.1 L5.2 U15.23(V_CORE)
NetC145_1: C145.1 U15.5(LDO_B_OUT)
NetC146_2: C146.2 U15.3(XTAL_I) Y2.3(OSC2)
NetC147_2: C147.2 U15.4(XTAL_O) Y2.1(OSC1)
NetC148_1: C148.1 U15.24(LDO_C_OUT)
NetC330_1: C330.1 FL1.C(Input)
NetC330_2: C330.2 C332.2 L9.1 R263.2
NetC335_1: C335.1 L9.2 U31.1(OUT)
NetC336_1: C336.1 L5.1 U15.22(V_DCDC_OUT)
NetC420_1: C420.1 U15.2(LDO_X_OUT)
NetFL1_A: FL1.A(Output) U15.40(LNA_IN)
NetR262_1: R262.1 U31.2(ILM)
NetU15_11: U15.11(RTC_O) Y4.2(OSC2)
NetU15_12: U15.12(RTC_I) Y4.1(OSC1)

Not connected (* = marked no-connect by the designer): ANT1 3*; U15 8(USB_DM)* 9(VDD_USB)* 10(USB_DP)* 13(PIO14)* 14(PIO13)* 15(TCK)* 16(TMS)* 20(T_SENSE)* 31(PIO8)* 32(PIO9)* 33(PIO10)* 35(PIO11)* 36(PIO15)* 37(PIO16)*

### Layout directives
net class RF 50ohm: (no net found under the mark), NetC330_1, NetFL1_A

### Notes on the sheet
- GPS
- UART2_RX
- UART2_TX
- First View Consultants
- Austin, Tx
- 512.582.9102
- Title:
- File:
- firstviewconsultants.com
- Drawn:
- Checked:
- Sheet
- Page Size:
- of
- B
- FVC #:
- Rev.
- Approved:
- Date:
- Time:

### Library data of the parts
ANT1 = 1575AT54A0010E: Antenna, GPS GLONASS, SMD; Manufacturer: Johanson Technology, Inc.; Operating Temperature: -40+85°C; Manufacturer #: 1575AT54A0010E
C138 C144 = Cap 4.7uF 10V 0603: Cap, Cer, 4.7uF, 10V, 10%, X5R, 0603; Manufacturer #: LMK107BJ475KA-T; Manufacturer: Taiyo Yuden; Have Footprint: yes; Tolerance: ±10%; Package: 0402
C139-C143 C148 C336 C420 = Cap 1uF 10V 0402: as C121 on sheet 7 WiFi; Package: 0402
C145 = Cap 2.2uF 10V 0402: as C110 on sheet 6 Bluetooth; Package: 0402
C146 C147 = Cap 18pF 50V 0402: as C115 on sheet 6 Bluetooth; Package: 0402
C329 = Cap 1uF 25V 0402: Cap, Cer, 1uF, 25V, 10%, X5R, 0402; Manufacturer #: TMK105BJ105MV-F; Manufacturer: Taiyo Yuden; Have Footprint: yes; Package: 0402
C330 = Cap 22pF 50V 0402: Cap, Cer, 22pF, 50V, 5%, C0G/NPO, 0402; Manufacturer #: CC0402JRNPO9BN220; Manufacturer: Yageo; Have Footprint: yes; Package: 0402
C331 C332 = Cap 0.1uF 10V 0402: as C111 on sheet 6 Bluetooth; Tolerance: ±10%; PACKAGE: 0402
C335 = Cap 0.1uF 16V 0402: as C122 on sheet 7 WiFi; Package: 0402; Tolerance: ±10%
FB18 FB19 = BLM18EG601SN1D: Ind, Ferrite Bead, 600R, 350mOhm, 0.5A, 0603; Manufacturer: Murata Electronics North America; Have Footprint: yes; Manufacturer #: BLM18EG601SN1D; Package: 0603
FB20 = BLM15HD182SN1: Ind, Ferrite Bead, 1.8K, 2.2Ohm, 0.2A, 0402; Manufacturer: Murata Electronics North America; RoHS: yes; Package: 0402; Manufacturer #: BLM15HD182SN1
FL1 = AFS14A34-1588.66-T3: Filter, SAW, 1.58866GHz, SMD; Manufacturer: Abracon; Package: SMD(1.4x1.1); Operating Temperature: -30°C ~ 85°C; RoHS: yes; Manufacturer #: AFS14A34-1588.66-T3
L5 = LQM2MPN2R2NG0L: Ind, Power, 2.2uH, 1.2A, 110 mOhm, 0806; Manufacturer: Murata Electronics North America; Tolerance: 25%; RoHS: yes; Operating Temperature: -55°C ~ 125°C; Package: 0806; Manufacturer #: LQM2MPN2R2NG0L
L9 = L-07C27NJV6T: Ind, RF, 27nH, 0.2A, 0402; Manufacturer: Johanson Technology Inc; Tolerance: 5%; RoHS: yes; Operating Temperature: -40°C ~ 100°C; Package: 0402; Manufacturer #: L-07C27NJV6T
R55 = Res 3.3K 0.063W: Res, 3.3K, 0.063W, 1%, 0402; Manufacturer #: MCR01MRTF3301; Manufacturer: Rohm Semiconductor; Have Footprint: yes; Package: 0402
R260 R261 R347-R349 = Res 10K 0.063W: as R34-R36 on sheet 6 Bluetooth; Package: 0402
  R347-R349: DNP: DNP
R262 = Res 49.9K 0.063W: Res, 49.9K, 0.063W, 1%, 0402; Manufacturer #: MCR01MRTF4992; Manufacturer: Rohm Semiconductor; Have Footprint: yes; Package: 0402; Operating Temperature: -55°C ~ 155°C
R263 R321 = Res 0 ohm 0.1W: as R32 on sheet 6 Bluetooth; Package: 0402
  R321: DNP: DNP
R298 R299 = Res 0 ohm 0.1W DNP: as R294 on sheet 6 Bluetooth; Package: 0402; DNP: DNP
R300 R301 = Res 100R 0.063W: as R290 on sheet 6 Bluetooth; Package: 0402
U11 = W25Q80DVSSIG: IC, Flash, SPI, 2.5/3/3.3V, 4M-bit, SOIC-8; Manufacturer: Winbond; Have Footprint: yes; RoHS: yes; Manufacturer #: W25Q80DVSSIG
U15 = UBX-G7020-KA: IC, GPS, QFN-40; Manufacturer: U-Blox; Have Footprint: yes; RoHS: yes; Manufacturer #: UBX-G7020-KA; Package: QFN-40
U31 = NCP380LMUAJAATBG: IC, Power Switch, Adj., 2.1A, UDFN-6; Manufacturer: ON Semiconductor; θJA: 120; Have Footprint: yes; Package: UDFN-6; Operating Temperature: -40°C ~ 125°C; RoHS: yes; Manufacturer #: NCP380LMUAJAATBG
Y2 = 403I35D26M00000: as Y1 on sheet 6 Bluetooth; Package: DFN(3.2x2.5mm); Manufacturer #: 403I35D26M00000
Y4 = SC32S-12.5PF20PPM: Clock, Crystal, 32.768kHz, 20ppm, 12.5pf, SMD; Manufacturer: Seiko Instruments; Operating Temperature: -40°C ~ 85°C; Package: SMD (3.2x1.5); Manufacturer #: SC32S-12.5PF20PPM

## Sheet 9 Microphone Input.SchDoc
size B; DocumentNumber: 9; SheetNumber: 9; SheetTotal: 17
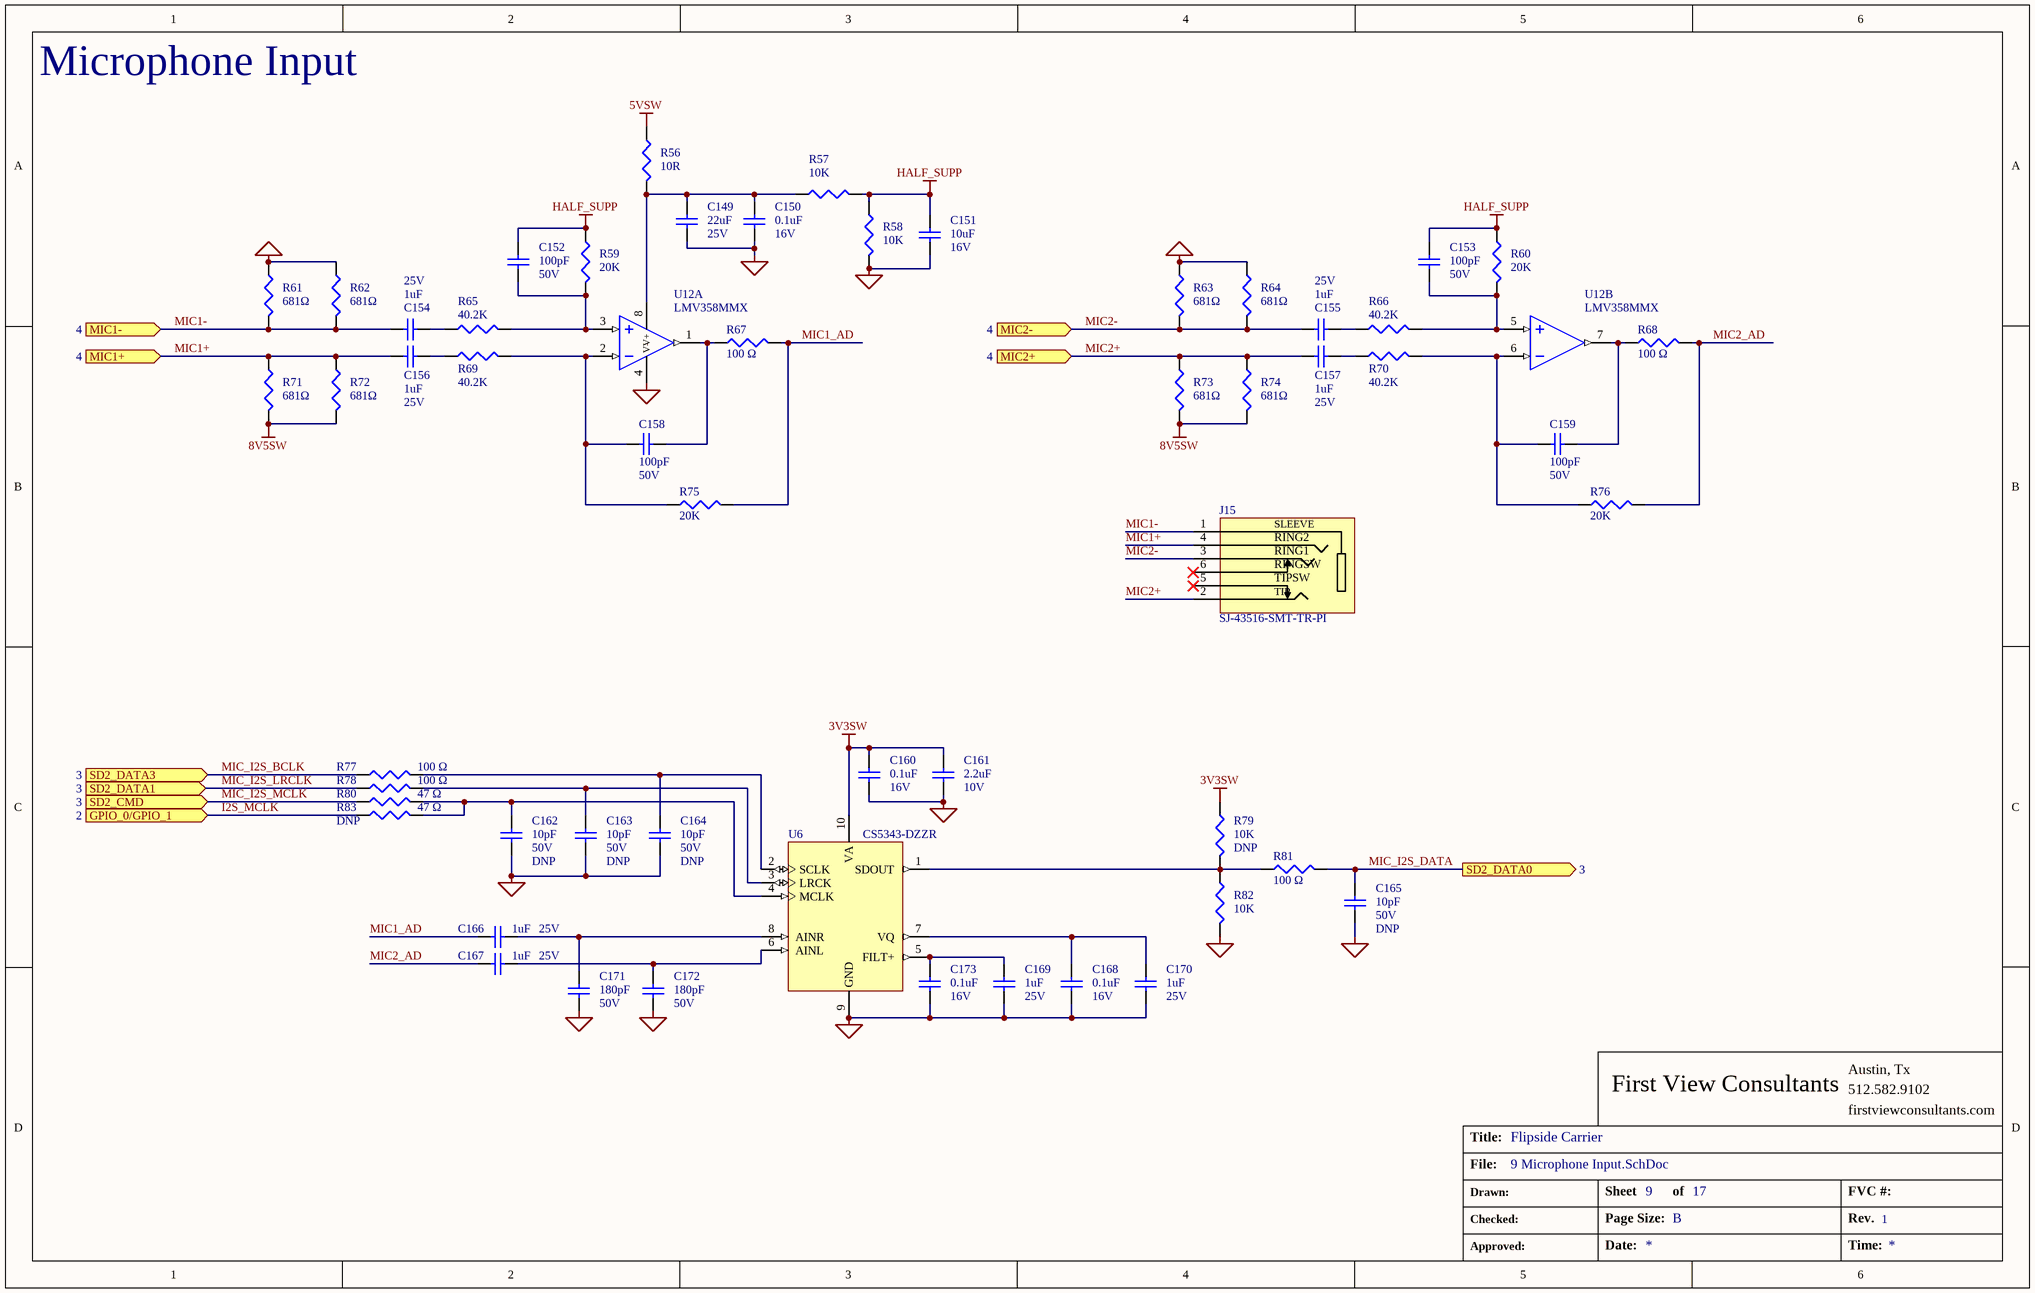
[diagram p8: 9 Microphone Input.SchDoc]

### Parts
C149  value 22uF  Voltage: 25V  [CAP_0805]  (hidden comment: Cap 22uF 25V 0805)
C150  value 0.1uF  Voltage: 16V  [CAP_0402]  (hidden comment: Cap 0.1uF 16V 0402)
C151  value 10uF  Voltage: 16V  [CAP_0603]  (hidden comment: Cap 10uF 16V 0603)
C152  value 100pF  Voltage: 50V  [CAP_0402]  (hidden comment: Cap 100pF 50V 0402)
C153  value 100pF  Voltage: 50V  [CAP_0402]  (hidden comment: Cap 100pF 50V 0402)
C154  value 1uF  Voltage: 25V  [CAP_0402]  (hidden comment: Cap 1uF 25V 0402)
C155  value 1uF  Voltage: 25V  [CAP_0402]  (hidden comment: Cap 1uF 25V 0402)
C156  value 1uF  Voltage: 25V  [CAP_0402]  (hidden comment: Cap 1uF 25V 0402)
C157  value 1uF  Voltage: 25V  [CAP_0402]  (hidden comment: Cap 1uF 25V 0402)
C158  value 100pF  Voltage: 50V  [CAP_0402]  (hidden comment: Cap 100pF 50V 0402)
C159  value 100pF  Voltage: 50V  [CAP_0402]  (hidden comment: Cap 100pF 50V 0402)
C160  value 0.1uF  Voltage: 16V  [CAP_0402]  (hidden comment: Cap 0.1uF 16V 0402)
C161  value 2.2uF  Voltage: 10V  [CAP_0402]  (hidden comment: Cap 2.2uF 10V 0402)
C162  value 10pF  Voltage: 50V  [CAP_0402]  (hidden comment: Cap 10pF 50V 0402)
C163  value 10pF  Voltage: 50V  [CAP_0402]  (hidden comment: Cap 10pF 50V 0402)
C164  value 10pF  Voltage: 50V  [CAP_0402]  (hidden comment: Cap 10pF 50V 0402)
C165  value 10pF  Voltage: 50V  [CAP_0402]  (hidden comment: Cap 10pF 50V 0402)
C166  value 1uF  Voltage: 25V  [CAP_0402]  (hidden comment: Cap 1uF 25V 0402)
C167  value 1uF  Voltage: 25V  [CAP_0402]  (hidden comment: Cap 1uF 25V 0402)
C168  value 0.1uF  Voltage: 16V  [CAP_0402]  (hidden comment: Cap 0.1uF 16V 0402)
C169  value 1uF  Voltage: 25V  [CAP_0402]  (hidden comment: Cap 1uF 25V 0402)
C170  value 1uF  Voltage: 25V  [CAP_0402]  (hidden comment: Cap 1uF 25V 0402)
C171  value 180pF  Voltage: 50V  [CAP_0402]  (hidden comment: Cap 180pF 50V 0402)
C172  value 180pF  Voltage: 50V  [CAP_0402]  (hidden comment: Cap 180pF 50V 0402)
C173  value 0.1uF  Voltage: 16V  [CAP_0402]  (hidden comment: Cap 0.1uF 16V 0402)
J15  SJ-43516-SMT-TR-PI  [CON_SJ-43516-SMT]
R56  value 10R  [RES_0402]  (hidden comment: Res 10R 0.1W)
R57  value 10K  [RES_0402]  (hidden comment: Res 10K 0.063W)
R58  value 10K  [RES_0402]  (hidden comment: Res 10K 0.063W)
R59  value 20K  [RES_0402]  (hidden comment: Res 20K 0.1W)
R60  value 20K  [RES_0402]  (hidden comment: Res 20K 0.1W)
R61  value 681Ω  [RES_1210]  (hidden comment: Res 681R 0.5W)
R62  value 681Ω  [RES_1210]  (hidden comment: Res 681R 0.5W)
R63  value 681Ω  [RES_1210]  (hidden comment: Res 681R 0.5W)
R64  value 681Ω  [RES_1210]  (hidden comment: Res 681R 0.5W)
R65  value 40.2K  [RES_0402]  (hidden comment: Res 40.2K 0.1W)
R66  value 40.2K  [RES_0402]  (hidden comment: Res 40.2K 0.1W)
R67  value 100 Ω  [RES_0402]  (hidden comment: Res 100R 0.063W)
R68  value 100 Ω  [RES_0402]  (hidden comment: Res 100R 0.063W)
R69  value 40.2K  [RES_0402]  (hidden comment: Res 40.2K 0.1W)
R70  value 40.2K  [RES_0402]  (hidden comment: Res 40.2K 0.1W)
R71  value 681Ω  [RES_1210]  (hidden comment: Res 681R 0.5W)
R72  value 681Ω  [RES_1210]  (hidden comment: Res 681R 0.5W)
R73  value 681Ω  [RES_1210]  (hidden comment: Res 681R 0.5W)
R74  value 681Ω  [RES_1210]  (hidden comment: Res 681R 0.5W)
R75  value 20K  [RES_0402]  (hidden comment: Res 20K 0.1W)
R76  value 20K  [RES_0402]  (hidden comment: Res 20K 0.1W)
R77  value 100 Ω  [RES_0402]  (hidden comment: Res 100R 0.063W)
R78  value 100 Ω  [RES_0402]  (hidden comment: Res 100R 0.063W)
R79  value 10K  [RES_0402]  (hidden comment: Res 10K 0.063W)
R80  value 47 Ω  [RES_0402]  (hidden comment: Res 47R 0.063W)
R81  value 100 Ω  [RES_0402]  (hidden comment: Res 100R 0.063W)
R82  value 10K  [RES_0402]  (hidden comment: Res 10K 0.063W)
R83  value 47 Ω  [RES_0402]  (hidden comment: Res 47R 0.063W)
U6  CS5343-DZZR  [TSSOP-10_CS5343]
U12  LMV358MMX  [VSSOP-8_LMV358MMX]  (parts A,B of 2)

### Ports
GPIO_0/GPIO_1 (in, see 2), MIC1+ (in, see 4), MIC1- (in, see 4), MIC2+ (in, see 4), MIC2- (in, see 4), SD2_CMD (in, see 3), SD2_DATA0 (out, see 3), SD2_DATA1 (in, see 3), SD2_DATA3 (in, see 3)

### Nets
3V3SW: C160.1 C161.1 R79.1 U6.10(VA)
5VSW: R56.1
8V5SW: R71.2 R72.2 R73.2 R74.2
GND: C149.2 C150.2 C151.2 C160.2 C161.2 C162.2 C163.2 C164.2 C165.2 C168.2 C169.2 C170.2 C171.2 C172.2 C173.2 R58.2 R61.1 R62.1 R63.1 R64.1 R82.2 U6.9(GND) U12.4(V-)
HALF_SUPP: C151.1 C152.1 C153.1 R57.2 R58.1 R59.1 R60.1
I2S_MCLK: R83.1 ; port GPIO_0/GPIO_1
MIC1+: C156.1 J15.4(RING_2) R71.1 R72.1 ; port MIC1+
MIC1-: C154.1 J15.1(SLEEVE) R61.2 R62.2 ; port MIC1-
MIC1_AD: C166.1 R67.2 R75.2
MIC2+: C157.1 J15.2(TIP) R73.1 R74.1 ; port MIC2+
MIC2-: C155.1 J15.3(RING_1) R63.2 R64.2 ; port MIC2-
MIC2_AD: C167.1 R68.2 R76.2
MIC_I2S_BCLK: R77.1 ; port SD2_DATA3
MIC_I2S_DATA: C165.1 R81.2 ; port SD2_DATA0
MIC_I2S_LRCLK: R78.1 ; port SD2_DATA1
MIC_I2S_MCLK: R80.1 ; port SD2_CMD
NetC149_1: C149.1 C150.1 R56.2 R57.1 U12.8(V+)
NetC152_2: C152.2 R59.2 R65.2 U12.3(INA+)
NetC153_2: C153.2 R60.2 R66.2 U12.5(INB+)
NetC154_2: C154.2 R65.1
NetC155_2: C155.2 R66.1
NetC156_2: C156.2 R69.1
NetC157_2: C157.2 R70.1
NetC158_1: C158.1 R69.2 R75.1 U12.2(INA-)
NetC158_2: C158.2 R67.1 U12.1(OUTA)
NetC159_1: C159.1 R70.2 R76.1 U12.6(INB-)
NetC159_2: C159.2 R68.1 U12.7(OUTB)
NetC162_1: C162.1 R80.2 R83.2 U6.4(MCLK)
NetC163_1: C163.1 R78.2 U6.3(LRCK)
NetC164_1: C164.1 R77.2 U6.2(SCLK)
NetC166_2: C166.2 C171.1 U6.8(AINR)
NetC167_2: C167.2 C172.1 U6.6(AINL)
NetC168_1: C168.1 C170.1 U6.7(VQ)
NetC169_1: C169.1 C173.1 U6.5(FILT+)
NetR79_2: R79.2 R81.1 R82.1 U6.1(SDOUT)

Not connected (* = marked no-connect by the designer): J15 5(TIP_SW)* 6(RING_SW)*

### Notes on the sheet
- Microphone Input
- First View Consultants
- Austin, Tx
- 512.582.9102
- Title:
- File:
- firstviewconsultants.com
- Drawn:
- Checked:
- Sheet
- Page Size:
- of
- B
- FVC #:
- Rev.
- Approved:
- Date:
- Time:
- (in symbol SJ-43516-SMT-TR-PI) RING2; RING1; RINGSW; TIPSW

### Library data of the parts
C149 = Cap 22uF 25V 0805: Cap, Cer, 22uF, 25V, 20%, X5R, 0805; Manufacturer #: CL21A226MAQNNNE; Manufacturer: Samsung Electro-Mechanics America, Inc; Have Footprint: yes; Tolerance: ±20%; Package: 0805
C150 C160 C168 C173 = Cap 0.1uF 16V 0402: as C122 on sheet 7 WiFi; Package: 0402; Tolerance: ±10%
C151 = Cap 10uF 16V 0603: Cap, Cer, 10uF, 16V, 20%, X5R, 0603; Manufacturer #: GRM188C81C106MA73D; Manufacturer: Murata Electronics North America; Have Footprint: yes; RoHS: yes; Tolerance: ±20%; Operating Temperature: -55°C ~ 85°C; Package: 0603
C152 C153 C158 C159 = Cap 100pF 50V 0402: Cap, Cer, 100pF, 50V, 5%, C0G/NP0, 0402; Manufacturer: Yageo; Manufacturer #: CC0402JRNPO9BN101; Have Footprint: yes; Tolerance: 5%; PACKAGE: 0402
C154-C157 C166 C167 C169 C170 = Cap 1uF 25V 0402: as C329 on sheet 8 GPS; Package: 0402
C161 = Cap 2.2uF 10V 0402: as C110 on sheet 6 Bluetooth; Package: 0402
C162-C165 = Cap 10pF 50V 0402: Cap, Cer, 10pF, 50V, 5%, C0G/NP0, 0402; Manufacturer #: CC0402JRNPO9BN100; Manufacturer: Yageo; Have Footprint: yes; PACKAGE: 0402; DNP: DNP; Operating Temperature: -55°C ~ 125°C; Tolerance: 5%
C171 C172 = Cap 180pF 50V 0402: as C123 on sheet 7 WiFi; Tolerance: 5%; PACKAGE: 0402
J15 = SJ-43516-SMT-TR-PI: Conn, Audio Jack, 3.5mm, Pink, SMD; Manufacturer: CUI Inc; Operating Temperature: -20°C ~ 85°C; Manufacturer #: SJ-43516-SMT-TR-PI
R56 = Res 10R 0.1W: as R46 on sheet 7 WiFi; Package: 0402
R57 R58 R79 R82 = Res 10K 0.063W: as R34-R36 on sheet 6 Bluetooth; Package: 0402
  R79: DNP: DNP
R59 R60 R75 R76 = Res 20K 0.1W: Res, 20K, 0.1W, 1%, 0402; Manufacturer #: ERJ-2RKF2002X; Manufacturer: Panasonic Electronic Components; Have Footprint: yes; Package: 0402
R61-R64 R71-R74 = Res 681R 0.5W: Res, 681R, 0.5W, 1%, 1210; Manufacturer #: ERJ-14NF6810U; Manufacturer: Panasonic Electronic Components; Package: 1210; Operating Temperature: -55°C ~ 155°C; Tolerance: 1%
R65 R66 R69 R70 = Res 40.2K 0.1W: Res, 40.2K, 0.1W, 1%, 0402; Manufacturer #: ERJ-2RKF4022X; Manufacturer: Panasonic Electronic Components; Have Footprint: yes; Package: 0402
R67 R68 R77 R78 R81 = Res 100R 0.063W: as R290 on sheet 6 Bluetooth; Package: 0402
R80 R83 = Res 47R 0.063W: Res, 47R, 0.063W, 5%, 0402; Manufacturer #: RMCF0402JT47R0; Manufacturer: Stackpole Electronics Inc; Have Footprint: yes; Package: 0402; Tolerance: 5%
  R83: DNP: DNP
U6 = CS5343-DZZR: IC, ADC, I2S, 98dB, Audio, TSSOP-10; Manufacturer: Cirrus Logic; Have Footprint: yes; RoHS: yes; Manufacturer #: CS5343-DZZR
U12 = LMV358MMX: IC, Dual Op Amp, 2.7-5V, VSSOP-8; Manufacturer: Texas Instruments; Have Footprint: yes; RoHS: yes; Manufacturer #: LMV358MMX

## Sheet 10 Audio Out.SchDoc
size B; DocumentNumber: 10; SheetNumber: 10; SheetTotal: 17
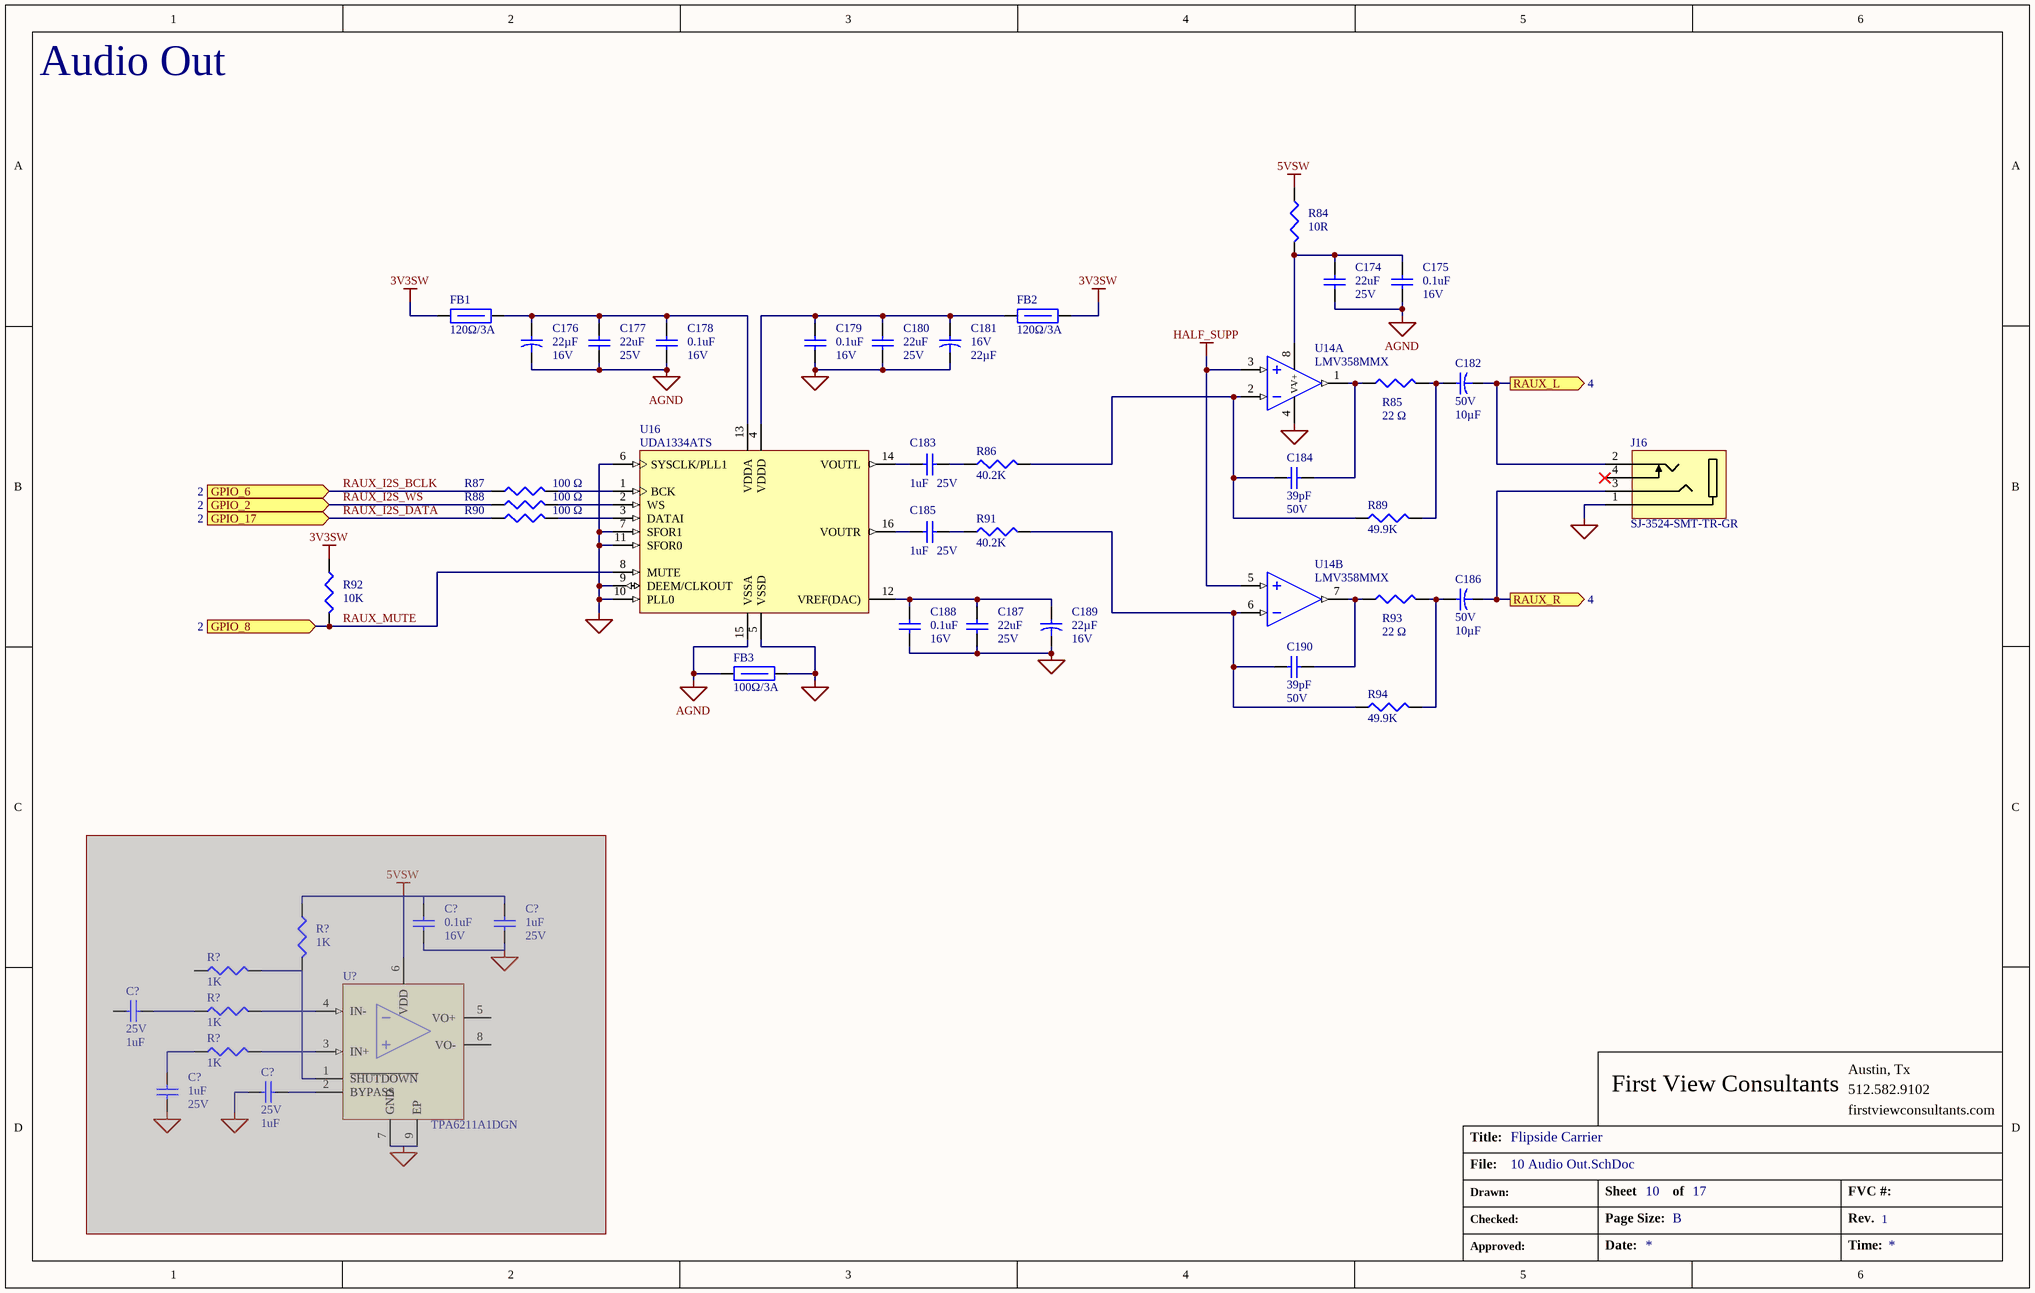
[diagram p9: 10 Audio Out.SchDoc]

### Parts
(Parts that share a designator on the sheet are numbered #1, #2 ... from top to bottom, then left to right.)
C174  value 22uF  Voltage: 25V  [CAP_0805]  (hidden comment: Cap 22uF 25V 0805)
C175  value 0.1uF  Voltage: 16V  [CAP_0402]  (hidden comment: Cap 0.1uF 16V 0402)
C176  value 22µF  Voltage: 16V  [SMD(5.3x5.3)_UWX1C220MCL1GB]  (hidden comment: Cap 22µF 16V)
C177  value 22uF  Voltage: 25V  [CAP_0805]  (hidden comment: Cap 22uF 25V 0805)
C178  value 0.1uF  Voltage: 16V  [CAP_0402]  (hidden comment: Cap 0.1uF 16V 0402)
C179  value 0.1uF  Voltage: 16V  [CAP_0402]  (hidden comment: Cap 0.1uF 16V 0402)
C180  value 22uF  Voltage: 25V  [CAP_0805]  (hidden comment: Cap 22uF 25V 0805)
C181  value 22µF  Voltage: 16V  [SMD(5.3x5.3)_UWX1C220MCL1GB]  (hidden comment: Cap 22µF 16V)
C182  value 10µF  Voltage: 50V  [SMD(6.6x6.6)_UWX1H100MCL1GB]  (hidden comment: Cap 10µF 50V)
C183  value 1uF  Voltage: 25V  [CAP_0402]  (hidden comment: Cap 1uF 25V 0402)
C184  value 39pF  Voltage: 50V  [CAP_0402]  (hidden comment: Cap 39pF 50V 0402)
C185  value 1uF  Voltage: 25V  [CAP_0402]  (hidden comment: Cap 1uF 25V 0402)
C186  value 10µF  Voltage: 50V  [SMD(6.6x6.6)_UWX1H100MCL1GB]  (hidden comment: Cap 10µF 50V)
C187  value 22uF  Voltage: 25V  [CAP_0805]  (hidden comment: Cap 22uF 25V 0805)
C188  value 0.1uF  Voltage: 16V  [CAP_0402]  (hidden comment: Cap 0.1uF 16V 0402)
C189  value 22µF  Voltage: 16V  [SMD(5.3x5.3)_UWX1C220MCL1GB]  (hidden comment: Cap 22µF 16V)
C190  value 39pF  Voltage: 50V  [CAP_0402]  (hidden comment: Cap 39pF 50V 0402)
C?#1  value 0.1uF  Voltage: 16V  [CAP_0402]  (hidden comment: Cap 0.1uF 16V 0402)  (masked out: inside a compile mask, not in the netlist)
C?#2  value 1uF  Voltage: 25V  [CAP_0402]  (hidden comment: Cap 1uF 25V 0402)  (masked out: inside a compile mask, not in the netlist)
C?#3  value 1uF  Voltage: 25V  [CAP_0402]  (hidden comment: Cap 1uF 25V 0402)  (masked out: inside a compile mask, not in the netlist)
C?#4  value 1uF  Voltage: 25V  [CAP_0402]  (hidden comment: Cap 1uF 25V 0402)  (masked out: inside a compile mask, not in the netlist)
C?#5  value 1uF  Voltage: 25V  [CAP_0402]  (hidden comment: Cap 1uF 25V 0402)  (masked out: inside a compile mask, not in the netlist)
FB1  value 120Ω/3A  [IND_0603]  (hidden comment: BLM18KG121TN1D)
FB2  value 120Ω/3A  [IND_0603]  (hidden comment: BLM18KG121TN1D)
FB3  value 100Ω/3A  [IND_0603]  (hidden comment: BLM18KG101TN1D)
J16  SJ-3524-SMT-TR-GR  [CON_SJ-3524-SMT-TR-GR]
R84  value 10R  [RES_0402]  (hidden comment: Res 10R 0.1W)
R85  value 22 Ω  [RES_0402]  (hidden comment: Res 22R 0.063W)
R86  value 40.2K  [RES_0402]  (hidden comment: Res 40.2K 0.1W)
R87  value 100 Ω  [RES_0402]  (hidden comment: Res 100R 0.063W)
R88  value 100 Ω  [RES_0402]  (hidden comment: Res 100R 0.063W)
R89  value 49.9K  [RES_0402]  (hidden comment: Res 49.9K 0.063W)
R90  value 100 Ω  [RES_0402]  (hidden comment: Res 100R 0.063W)
R91  value 40.2K  [RES_0402]  (hidden comment: Res 40.2K 0.1W)
R92  value 10K  [RES_0402]  (hidden comment: Res 10K 0.063W)
R93  value 22 Ω  [RES_0402]  (hidden comment: Res 22R 0.063W)
R94  value 49.9K  [RES_0402]  (hidden comment: Res 49.9K 0.063W)
R?#1  value 1K  [RES_0402]  (hidden comment: Res 1K 0.063W)  (masked out: inside a compile mask, not in the netlist)
R?#2  value 1K  [RES_0402]  (hidden comment: Res 1K 0.063W)  (masked out: inside a compile mask, not in the netlist)
R?#3  value 1K  [RES_0402]  (hidden comment: Res 1K 0.063W)  (masked out: inside a compile mask, not in the netlist)
R?#4  value 1K  [RES_0402]  (hidden comment: Res 1K 0.063W)  (masked out: inside a compile mask, not in the netlist)
U14  LMV358MMX  [VSSOP-8_LMV358MMX]  (parts A,B of 2)
U16  UDA1334ATS  [SSOP-16_UDA1334ATS]
U?  TPA6211A1DGN  [MSOP-8_TPA6211A1DGN]  (masked out: inside a compile mask, not in the netlist)

### Ports
GPIO_2 (in, see 2), GPIO_6 (in, see 2), GPIO_8 (in, see 2), GPIO_17 (in, see 2), RAUX_L (out, see 4), RAUX_R (out, see 4)

### Nets
3V3SW: FB1.1 FB2.1 R92.1
5VSW: R84.1
AGND: C174.2 C175.2 C176.2 C177.2 C178.2 FB3.1 U16.15(VSSA)
GND: C179.2 C180.2 C181.2 C187.2 C188.2 C189.2 FB3.2 J16.1(SLEEVE) U14.4(V-) U16.5(VSSD) U16.6(SYSCLK/PLL1) U16.7(SFOR1) U16.9(DEEM/CLKOUT) U16.10(PLL0) U16.11(SFOR0)
HALF_SUPP: U14.3(INA+) U14.5(INB+)
RAUX_I2S_BCLK: R87.1 ; port GPIO_6
RAUX_I2S_DATA: R90.1 ; port GPIO_17
RAUX_I2S_WS: R88.1 ; port GPIO_2
RAUX_MUTE: R92.2 U16.8(MUTE) ; port GPIO_8
NetC47_1: C186.2 J16.3(RING) ; port RAUX_R
NetC48_1: C182.2 J16.2(TIP) ; port RAUX_L
NetC174_1: C174.1 C175.1 R84.2 U14.8(V+)
NetC176_1: C176.1 C177.1 C178.1 FB1.2 U16.13(VDDA)
NetC179_1: C179.1 C180.1 C181.1 FB2.2 U16.4(VDDD)
NetC182_1: C182.1 R85.2 R89.2
NetC183_1: C183.1 U16.14(VOUTL)
NetC183_2: C183.2 R86.1
NetC184_1: C184.1 R86.2 R89.1 U14.2(INA-)
NetC184_2: C184.2 R85.1 U14.1(OUTA)
NetC185_1: C185.1 U16.16(VOUTR)
NetC185_2: C185.2 R91.1
NetC186_1: C186.1 R93.2 R94.2
NetC187_1: C187.1 C188.1 C189.1 U16.12(VREF(DAC))
NetC190_1: C190.1 R91.2 R94.1 U14.6(INB-)
NetC190_2: C190.2 R93.1 U14.7(OUTB)
NetR87_2: R87.2 U16.1(BCK)
NetR88_2: R88.2 U16.2(WS)
NetR90_2: R90.2 U16.3(DATAI)

Not connected (* = marked no-connect by the designer): J16 4(TIP_SW)*

### Notes on the sheet
- Audio Out
- First View Consultants
- Austin, Tx
- 512.582.9102
- Title:
- File:
- firstviewconsultants.com
- Drawn:
- Checked:
- Sheet
- Page Size:
- of
- B
- FVC #:
- Rev.
- Approved:
- Date:
- Time:

### Library data of the parts
C174 C177 C180 C187 = Cap 22uF 25V 0805: as C149 on sheet 9 Microphone Input; Tolerance: ±20%; Package: 0805
C175 C178 C179 C188 C?#1 = Cap 0.1uF 16V 0402: as C122 on sheet 7 WiFi; Package: 0402; Tolerance: ±10%
C176 C181 C189 = Cap 22µF 16V: Cap, Alum, 22µF, 16V, 20%, SMD; Manufacturer #: UWX1C220MCL1GB; Manufacturer: Nichicon; Tolerance: 20%; Package: SMD  (5.3x5.3); Operating Temperature: -40°C ~ 85°C
C182 C186 = Cap 10µF 50V: Cap, Alum, 10µF, 50V, 20%, SMD; Manufacturer #: UWX1H100MCL1GB; Manufacturer: Nichicon; Tolerance: 20%; Package: SMD (6.6x6.6); Operating Temperature: -40°C ~ 85°C
C183 C185 C?#2-C?#5 = Cap 1uF 25V 0402: as C329 on sheet 8 GPS; Package: 0402
C184 C190 = Cap 39pF 50V 0402: Cap, Cer, 39pF, 50V, 5%, C0G/NP0, 0402; Manufacturer: Yageo; Manufacturer #: CC0402JRNPO9BN390; Have Footprint: yes; Tolerance: 5%; PACKAGE: 0402; Operating Temperature: -55°C ~ 125°C
FB1 FB2 = BLM18KG121TN1D: as FB14 on sheet 6 Bluetooth; RoHS: yes; Package: 0603; Manufacturer #: BLM18KG121TN1D
FB3 = BLM18KG101TN1D: Ind, Ferrite Bead, 100R, 30mOhm, 3A, 0603; Manufacturer: Murata Electronics North America; Have Footprint: yes; RoHS: yes; Package: 0603; Manufacturer #: BLM18KG101TN1D
J16 = SJ-3524-SMT-TR-GR: Conn, Audio Jack, 3.5mm, Green, SMD; Manufacturer: CUI Inc; Operating Temperature: -20°C ~ 85°C; Manufacturer #: SJ-3524-SMT-TR-GR
R84 = Res 10R 0.1W: as R46 on sheet 7 WiFi; Package: 0402
R85 R93 = Res 22R 0.063W: Res, 22R, 0.063W, 1%, 0402; Manufacturer #: RC0402FR-0722RL; Manufacturer: Yageo; Have Footprint: yes; Tolerance: ±1%; RoHS: yes; Cost: *; Package: 0402
R86 R91 = Res 40.2K 0.1W: as R65 on sheet 9 Microphone Input; Package: 0402
R87 R88 R90 = Res 100R 0.063W: as R290 on sheet 6 Bluetooth; Package: 0402
R89 R94 = Res 49.9K 0.063W: as R262 on sheet 8 GPS; Package: 0402; Operating Temperature: -55°C ~ 155°C
R92 = Res 10K 0.063W: as R34-R36 on sheet 6 Bluetooth; Package: 0402
R?#1-R?#4 = Res 1K 0.063W: Res, 1K, 0.063W, 1%, 0402; Manufacturer #: CRCW04021K00FKED; Manufacturer: Vishay Dale; Have Footprint: yes; Package: 0402; Tolerance: ±1%
U14 = LMV358MMX: as U12 on sheet 9 Microphone Input; RoHS: yes; Manufacturer #: LMV358MMX
U16 = UDA1334ATS: IC, DAC, I2S, 2.4-3.6V, 2-ch, 24-bit, SSOP-16; Manufacturer: NXP Semiconductor; Package: SSOP-16; Manufacturer #: UDA1334ATS
U? = TPA6211A1DGN: IC, Amp, 3.1W, 2.5-5.5V, MSOP-8; Manufacturer: Texas Instruments; Have Footprint: yes; Package: MSOP-8; RoHS: yes; Manufacturer #: TPA6211A1DGN